# EasyEDA Pro project megaduck.epro

# Schematic Schematic1
Board Name: Board1; Create Date: 2025-01-31; Page Name: P1; Project Name: mega 2560 duck; Schematic Name: Schematic1; Update Date: 2025-01-31; Company: EasyEDA.com; Page Size: A4; Version: V1.0
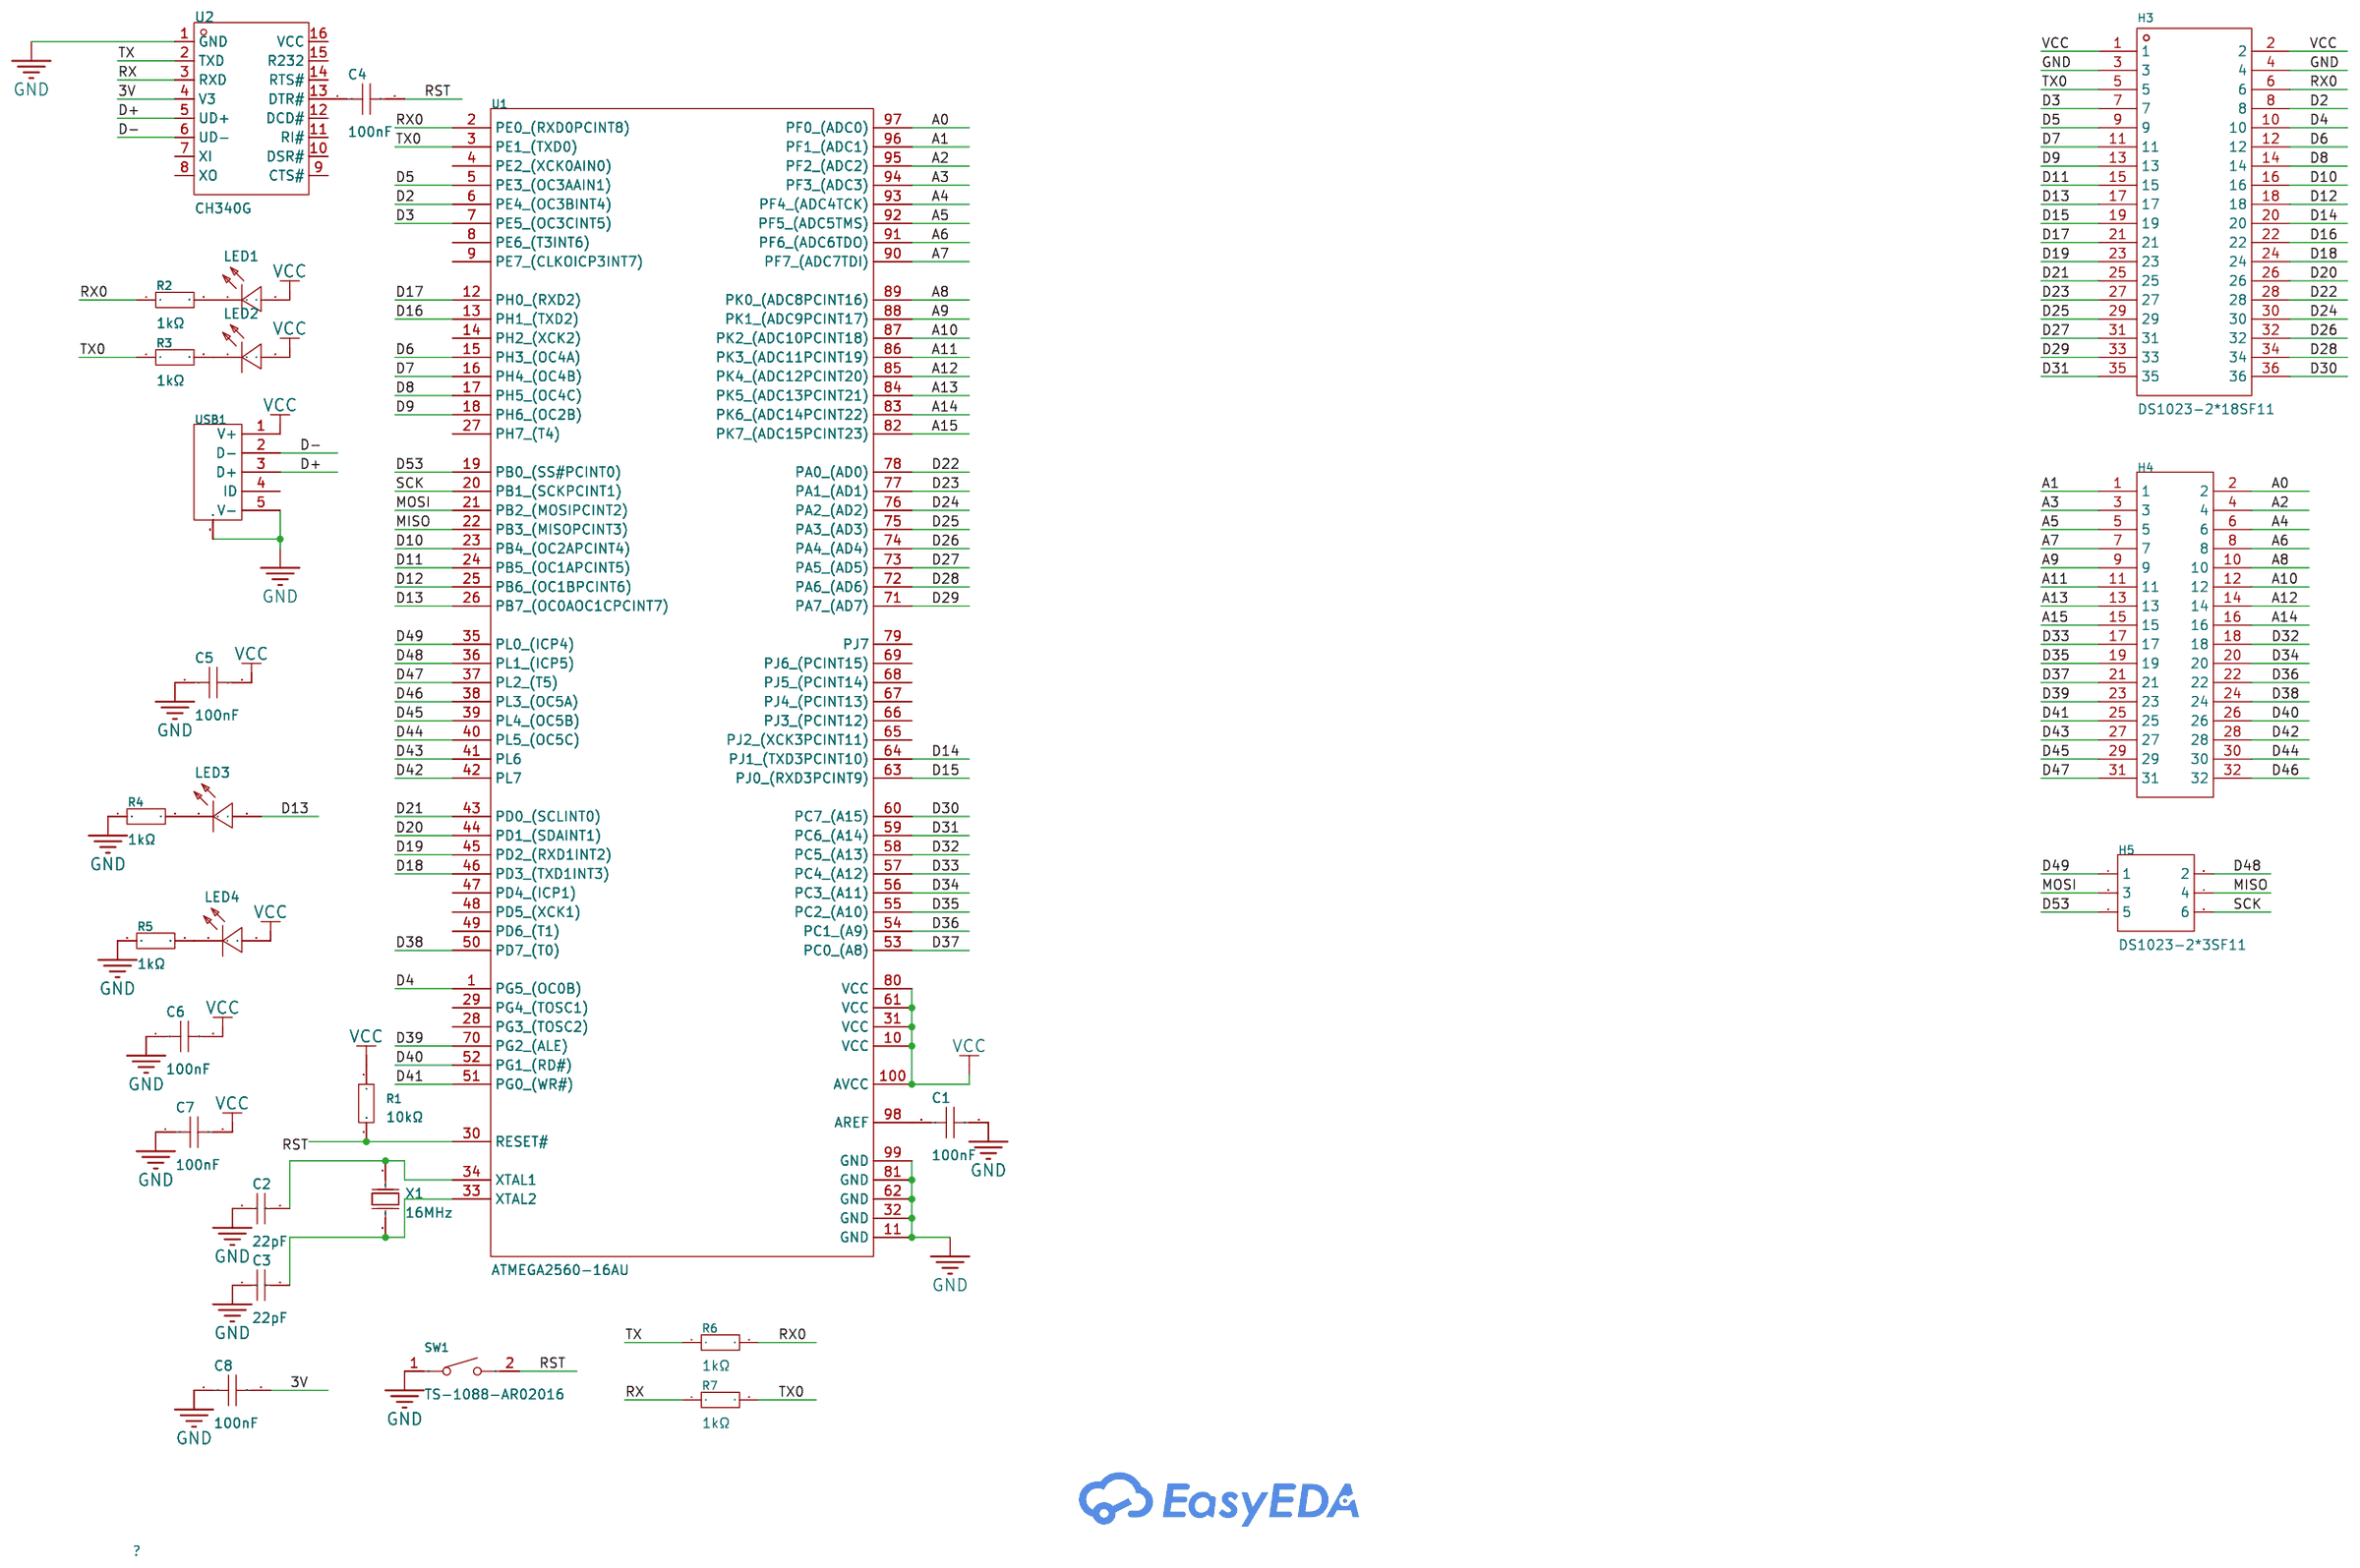
[diagram p0: schematic sheet]

## Parts
C1  100nF  [C0402]
C2  22pF  [C0402]
C3  22pF  [C0402]
C4  100nF  [C0402]
C5  100nF  [C0402]
C6  100nF  [C0402]
C7  100nF  [C0402]
C8  100nF  [C0402]
H3  DS1023-2*18SF11  [HDR-TH_36P-P2.54-V-F-R2-C18-S2.54-1]
H4  DS1023-2*16SF11  [HDR-TH_32P-P2.54-V-F-R2-C16-S2.54-1]
H5  DS1023-2*3SF11  [HDR-TH_6P-P2.54-V-F-R2-C3-S2.54]
LED1  KT-0603R  [LED0603-RD]
LED2  KT-0603R  [LED0603-RD]
LED3  KT-0603R  [LED0603-RD]
LED4  KT-0603R  [LED0603-RD]
R1  10kΩ  [R1206]
R2  1kΩ  [R1206]
R3  1kΩ  [R1206]
R4  1kΩ  [R1206]
R5  1kΩ  [R1206]
R6  1kΩ  [R1206]
R7  1kΩ  [R1206]
SW1  TS-1088-AR02016  [SW-SMD_L3.9-W3.0-P4.45]
U1  ATMEGA2560-16AU  [TQFP-100_L14.0-W14.0-P0.50-LS16.0-BL]
U2  CH340G  [SOIC-16_L9.9-W3.9-P1.27-LS6.0-BL]
USB1  920-E52A2021S10100  [MICRO-USB-SMD_5P-P0.65-H-F_C10418]
X1  16MHz  [HC-49S_L11.4-W4.8]

## Library data of the parts
C1 C4-C8 = CL05B104KO5NNNC: Capacitance: Tolerance:±10% Tolerance:±10% Voltage Rated: Temperature Coefficient:; LCSC Part Name: 100nF ±10% 16V; Supplier Part: C1525; Manufacturer: SAMSUNG(三星); Supplier Footprint: 0402; JLCPCB Part Class: Basic Part; Datasheet: https://atta.szlcsc.com/upload/public/pdf/source/20160218/1457707763339.pdf; Supplier: LCSC; Tolerance: ±10%
C2 C3 = 0402CG220J500NT: Capacitance: Tolerance:±5% Tolerance:±5% Voltage Rated: Temperature Coefficient:; LCSC Part Name: 22pF ±5% 50V; Supplier Part: C1555; Manufacturer: FH(风华); Supplier Footprint: 0402; JLCPCB Part Class: Basic Part; Datasheet: https://atta.szlcsc.com/upload/public/pdf/source/20200305/C486355_26A10D38EF8C2A5C37091D0039909270.pdf; Supplier: LCSC; Tolerance: ±5%
H3 = DS1023-2*18SF11: Holes Structure:2x18P Pitch:2.54mm Row Spacing:2.54mm Mounting Type:Straight Number of Rows:双排 Number of Holes:36P Insulation Height:- Contact Material:- Contact Plating:-; LCSC Part Name: 间距:2.54mm 2x18P 直插; Supplier Part: C132131; Manufacturer: CONNFLY; Supplier Footprint: 插件,P=2.54mm; JLCPCB Part Class: Extended Part; Datasheet: https://atta.szlcsc.com/upload/public/pdf/source/20170925/C132132_1506321659018990428.pdf; Supplier: LCSC; Holes Structure: 2x18P; Pitch: 2.54mm; Row Spacing: 2.54mm; Mounting Type: Straight; Number of Rows: 双排; Number of Holes: 36P
H4 = DS1023-2*16SF11: Holes Structure:2x16P Pitch:2.54mm Row Spacing:2.54mm Mounting Type:Straight Number of Rows:双排 Number of Holes:32P Insulation Height:- Contact Material:- Contact Plating:-; LCSC Part Name: 间距:2.54mm 2x16P 直插; Supplier Part: C132130; Manufacturer: CONNFLY; Supplier Footprint: 插件,P=2.54mm; JLCPCB Part Class: Extended Part; Datasheet: https://atta.szlcsc.com/upload/public/pdf/source/20170925/C132132_1506321659018990428.pdf; Supplier: LCSC; Holes Structure: 2x16P; Pitch: 2.54mm; Row Spacing: 2.54mm; Mounting Type: Straight; Number of Rows: 双排; Number of Holes: 32P
H5 = DS1023-2*3SF11: Holes Structure:2x3P Pitch:2.54mm Row Spacing:2.54mm Mounting Type:Straight Number of Rows:双排 Number of Holes:6P Insulation Height:- Contact Material:- Contact Plating:-; LCSC Part Name: 间距:2.54mm 2x3P 直插 黑色; Supplier Part: C92272; Manufacturer: CONNFLY; Supplier Footprint: 插件,P=2.54mm; JLCPCB Part Class: Extended Part; Datasheet: https://atta.szlcsc.com/upload/public/pdf/source/20200424/C92272_A95D2DA05ACA87B9C9B122019351705D.pdf; Supplier: LCSC; Holes Structure: 2x3P; Pitch: 2.54mm; Row Spacing: 2.54mm; Mounting Type: Straight; Number of Rows: 双排; Number of Holes: 6P
LED1-LED4 = KT-0603R: Emitted Color:Red Power Dissipation:- Forward Current:- Dominant Wavelength:- Dominant Wavelength:- Peak Wavelength:- Diode Configuration:- Lens Color:- Color Temperature:- Color Temperature:- Viewing Angle:- Mounting Sytle:- Operating Temperature:-40℃~+8; LCSC Part Name: 0603 红灯 高亮; Supplier Part: C2286; Manufacturer: KENTO; Supplier Footprint: 0603; JLCPCB Part Class: Basic Part; Datasheet: https://atta.szlcsc.com/upload/public/pdf/source/20160616/1466072038404.pdf; Supplier: LCSC; Emitted Color: Red; Operating Temperature: -40℃~+85℃
R1 = 1206W4J0103T5E: Type:Thick Film Resistors Resistance:10kΩ Tolerance:±5% Tolerance:±5% Power(Watts): Overload Voltage (Max): Temperature Coefficient:±100ppm/℃ Temperature Coefficient:±100ppm/℃ Operating Temperature Range:-55℃~+155℃ Operating Temperature Range:-55℃~+155℃; LCSC Part Name: 10kΩ ±5% 250mW 厚膜电阻; Supplier Part: C1489; Manufacturer: UNI-ROYAL(厚声); Supplier Footprint: 1206; JLCPCB Part Class: Extended Part; Datasheet: https://atta.szlcsc.com/upload/public/pdf/source/20200306/C422600_1E6D84923E4A46A82E41ADD87F860B5C.pdf; Supplier: LCSC; Type: Thick Film Resistors; Tolerance: ±5%; Temperature Coefficient: ±100ppm/℃; Operating Temperature Range: -55℃~+155℃
R2-R7 = 1206W4F1001T5E_C4410: Type:Thick Film Resistors Resistance:1kΩ Tolerance:±1% Tolerance:±1% Power(Watts): Overload Voltage (Max): Operating Temperature Range:-55℃~+155℃ Operating Temperature Range:-55℃~+155℃; LCSC Part Name: 1kΩ ±1% 250mW 厚膜电阻; Supplier Part: C4410; Manufacturer: UNI-ROYAL(厚声); Manufacturer Part: 1206W4F1001T5E; Supplier Footprint: 1206; JLCPCB Part Class: Basic Part; Datasheet: https://atta.szlcsc.com/upload/public/pdf/source/20200306/C422600_1E6D84923E4A46A82E41ADD87F860B5C.pdf; Supplier: LCSC; Type: Thick Film Resistors; Tolerance: ±1%; Operating Temperature Range: -55℃~+155℃
SW1 = TS-1088-AR02016: Circuit:SPST Actuator Style:Round Button Operating Force:160gf Mounting Style:Brick nogging Switch Length:4mm Switch Width:3mm Switch Height:2mm Strike Gundam:不带 Contact Current:50mA Voltage Rating (DC):12V Insulation Resistance:100MΩ Actuator/Cap Color:B; LCSC Part Name: 4*3*2mm 立贴 轻触开关; Supplier Part: C720477; Manufacturer: XUNPU(讯普); Supplier Footprint: SMD; JLCPCB Part Class: Extended Part; Datasheet: https://atta.szlcsc.com/upload/public/pdf/source/20200810/C720475_60D09DD6C54279ADDB2DC25100F1CC11.pdf; Supplier: LCSC; Circuit: SPST; Actuator Style: Round Button; Operating Force: 160gf; Mounting Style: Brick nogging; Switch Length: 4mm; Switch Width: 3mm; Switch Height: 2mm; Strike Gundam: 不带; Contact Current: 50mA; Voltage Rating (DC): 12V; Insulation Resistance: 100MΩ; Actuator/Cap Color: Black; Pin Style: SMDSplicing; Mechanical Life: 10万次; Operating Temperature: -30℃~+80℃
U1 = ATMEGA2560-16AU: CPU Core:AVR Program Storage Size:256KB RAM Size:8KB GPIO Ports Number:86 Operating Voltage Range:4.5V~5.5V Operating Voltage Range:4.5V~5.5V CPU Maximum Speed:16MHz Program Memory Type:FLASH EEPROM:4KB Operating Temperature Range:-40℃~+85℃ Operating Temp; LCSC Part Name: ATMEGA2560-16AU MSL=3; Supplier Part: C22460; Manufacturer: MICROCHIP(美国微芯); Supplier Footprint: TQFP-100(14x14); JLCPCB Part Class: Extended Part; Datasheet: https://atta.szlcsc.com/upload/public/pdf/source/20180629/C184061_12C3FF49A7078B074E4E6578B2EA6640.pdf; Supplier: LCSC; CPU Core: AVR; Program Storage Size: 256KB; RAM Size: 8KB; GPIO Ports Number: 86; Operating Voltage Range: 4.5V~5.5V; CPU Maximum Speed: 16MHz; Program Memory Type: FLASH; EEPROM: 4KB; Operating Temperature Range: -40℃~+85℃; ADC (Bit): 10bit; Peripheral/Function: WDT；PWM; Watchdog: 有; Low-Voltage Detect: 有; Internal Oscillator: 有
U2 = CH340G: Applications Function:USB to UART Protocol: Supply Voltage:5V；3.3V Supply Voltage:5V；3.3V Data Rate:2Mbps Operating Temperature:-40℃~+85℃ Operating Temperature:-40℃~+85℃; LCSC Part Name: USB转串口芯片CH340; Supplier Part: C14267; Manufacturer: WCH(南京沁恒); Supplier Footprint: SOP-16; JLCPCB Part Class: Extended Part; Datasheet: https://atta.szlcsc.com/upload/public/pdf/source/20240313/8510303D24D987FBF1AD30058571F10E.pdf; Supplier: LCSC; Applications Function: USB to UART; Supply Voltage: 5V；3.3V; Data Rate: 2Mbps; Operating Temperature: -40℃~+85℃
USB1 = 920-E52A2021S10100: Connector Type:Micro-B Standard:USB 2.0 Gender:Female Number of Ports:1 Number of Contacts:5P Current Rating - Power (Max):1A; LCSC Part Name: Micro-B 母; Supplier Part: C10418; Manufacturer: 精拓金; Supplier Footprint: SMD; JLCPCB Part Class: Extended Part; Datasheet: https://atta.szlcsc.com/upload/public/pdf/source/20210305/C10418_4890444E73C7CF5EB311058F76E5ECA4.pdf; Supplier: LCSC; Connector Type: Micro-B; Standard: USB 2.0; Gender: Female; Number of Ports: 1; Number of Contacts: 5P; Current Rating - Power (Max): 1A
X1 = X49SM16MSD2SC: Crystal Type:Surface Mount Crystal Frequency: Normal temperature Frequency Tolerance:±20ppm Normal temperature Frequency Tolerance:±20ppm External load capacitor: Frequency Stability(Full temperature range):±30ppm Frequency Stability(Full temperature rang; LCSC Part Name: 16MHz ±20ppm 20pF; Supplier Part: C12676; Manufacturer: YXC(扬兴晶振); Supplier Footprint: HC-49S-SMD; JLCPCB Part Class: Extended Part; Datasheet: https://atta.szlcsc.com/upload/public/pdf/source/20240329/3EBF42EBCAB50CA65B6FA9D7CFA1955A.pdf; Supplier: LCSC; Crystal Type: Surface Mount Crystal; Normal temperature Frequency Tolerance: ±20ppm; Frequency Stability(Full temperature range): ±30ppm

## Nets
3V: C8.2 U2.4(V3)
GND: C1.2 C2.1 C3.1 C5.1 C6.1 C7.1 C8.1 H3.3 H3.4 R4.1 R5.1 SW1.1 U1.11(GND) U1.32(GND) U1.62(GND) U1.81(GND) U1.99(GND) U2.1(GND) USB1.5(V-) USB1.SH0(MTN) USB1.SH1(1) USB1.SH2(2) USB1.SH3(3)
VCC: C5.2 C6.2 C7.2 H3.1 H3.2 LED1.2(A) LED2.2(A) LED4.2(A) R1.1 U1.10(VCC) U1.31(VCC) U1.61(VCC) U1.80(VCC) U1.100(AVCC) USB1.1(V+)
A0: H4.2 U1.97(PF0 (ADC0))
A1: H4.1 U1.96(PF1 (ADC1))
A2: H4.4 U1.95(PF2 (ADC2))
A3: H4.3 U1.94(PF3 (ADC3))
A4: H4.6 U1.93(PF4 (ADC4TCK))
A5: H4.5 U1.92(PF5 (ADC5TMS))
A6: H4.8 U1.91(PF6 (ADC6TDO))
A7: H4.7 U1.90(PF7 (ADC7TDI))
A8: H4.10 U1.89(PK0 (ADC8PCINT16))
A9: H4.9 U1.88(PK1 (ADC9PCINT17))
A10: H4.12 U1.87(PK2 (ADC10PCINT18))
A11: H4.11 U1.86(PK3 (ADC11PCINT19))
A12: H4.14 U1.85(PK4 (ADC12PCINT20))
A13: H4.13 U1.84(PK5 (ADC13PCINT21))
A14: H4.16 U1.83(PK6 (ADC14PCINT22))
A15: H4.15 U1.82(PK7 (ADC15PCINT23))
D2: H3.8 U1.6(PE4 (OC3BINT4))
D3: H3.7 U1.7(PE5 (OC3CINT5))
D4: H3.10 U1.1(PG5 (OC0B))
D5: H3.9 U1.5(PE3 (OC3AAIN1))
D6: H3.12 U1.15(PH3 (OC4A))
D7: H3.11 U1.16(PH4 (OC4B))
D8: H3.14 U1.17(PH5 (OC4C))
D9: H3.13 U1.18(PH6 (OC2B))
D10: H3.16 U1.23(PB4 (OC2APCINT4))
D11: H3.15 U1.24(PB5 (OC1APCINT5))
D12: H3.18 U1.25(PB6 (OC1BPCINT6))
D13: H3.17 LED3.2(A) U1.26(PB7 (OC0AOC1CPCINT7))
D14: H3.20 U1.64(PJ1 (TXD3PCINT10))
D15: H3.19 U1.63(PJ0 (RXD3PCINT9))
D16: H3.22 U1.13(PH1 (TXD2))
D17: H3.21 U1.12(PH0 (RXD2))
D18: H3.24 U1.46(PD3 (TXD1INT3))
D19: H3.23 U1.45(PD2 (RXD1INT2))
D20: H3.26 U1.44(PD1 (SDAINT1))
D21: H3.25 U1.43(PD0 (SCLINT0))
D22: H3.28 U1.78(PA0 (AD0))
D23: H3.27 U1.77(PA1 (AD1))
D24: H3.30 U1.76(PA2 (AD2))
D25: H3.29 U1.75(PA3 (AD3))
D26: H3.32 U1.74(PA4 (AD4))
D27: H3.31 U1.73(PA5 (AD5))
D28: H3.34 U1.72(PA6 (AD6))
D29: H3.33 U1.71(PA7 (AD7))
D30: H3.36 U1.60(PC7 (A15))
D31: H3.35 U1.59(PC6 (A14))
D32: H4.18 U1.58(PC5 (A13))
D33: H4.17 U1.57(PC4 (A12))
D34: H4.20 U1.56(PC3 (A11))
D35: H4.19 U1.55(PC2 (A10))
D36: H4.22 U1.54(PC1 (A9))
D37: H4.21 U1.53(PC0 (A8))
D38: H4.24 U1.50(PD7 (T0))
D39: H4.23 U1.70(PG2 (ALE))
D40: H4.26 U1.52(PG1 (RD#))
D41: H4.25 U1.51(PG0 (WR#))
D42: H4.28 U1.42(PL7)
D43: H4.27 U1.41(PL6)
D44: H4.30 U1.40(PL5 (OC5C))
D45: H4.29 U1.39(PL4 (OC5B))
D46: H4.32 U1.38(PL3 (OC5A))
D47: H4.31 U1.37(PL2 (T5))
D48: H5.2 U1.36(PL1 (ICP5))
D49: H5.1 U1.35(PL0 (ICP4))
D53: H5.5 U1.19(PB0 (SS#PCINT0))
D+: U2.5(UD+) USB1.3(D+)
D-: U2.6(UD-) USB1.2(D-)
MISO: H5.4 U1.22(PB3 (MISOPCINT3))
MOSI: H5.3 U1.21(PB2 (MOSIPCINT2))
RST: C4.2 R1.2 SW1.2 U1.30(RESET#)
RX: R7.1 U2.3(RXD)
RX0: H3.6 R2.1 R6.2 U1.2(PE0 (RXD0PCINT8))
SCK: H5.6 U1.20(PB1 (SCKPCINT1))
TX: R6.1 U2.2(TXD)
TX0: H3.5 R3.1 R7.2 U1.3(PE1 (TXD0))
$1N1069: C1.1 U1.98(AREF)
$1N1420: C2.2 U1.34(XTAL1) X1.1(OSC1)
$1N1443: C3.2 U1.33(XTAL2) X1.2(OSC2)
$1N1959: C4.1 U2.13(DTR#)
Net-(LED1-1): LED1.1(K) R2.2
Net-(LED2-1): LED2.1(K) R3.2
Net-(LED3-1): LED3.1(K) R4.2
Net-(LED4-1): LED4.1(K) R5.2

Not connected (* = marked no-connect by the designer): U1 4(PE2 (XCK0AIN0)) 8(PE6 (T3INT6)) 9(PE7 (CLKOICP3INT7)) 14(PH2 (XCK2)) 27(PH7 (T4)) 28(PG3 (TOSC2)) 29(PG4 (TOSC1)) 47(PD4 (ICP1)) 48(PD5 (XCK1)) 49(PD6 (T1)) 65(PJ2 (XCK3PCINT11)) 66(PJ3 (PCINT12)) 67(PJ4 (PCINT13)) 68(PJ5 (PCINT14)) 69(PJ6 (PCINT15)) 79(PJ7); U2 7(XI) 8(XO) 9(CTS#) 10(DSR#) 11(RI#) 12(DCD#) 14(RTS#) 15(R232) 16(VCC); USB1 4(ID)

# Board PCB1
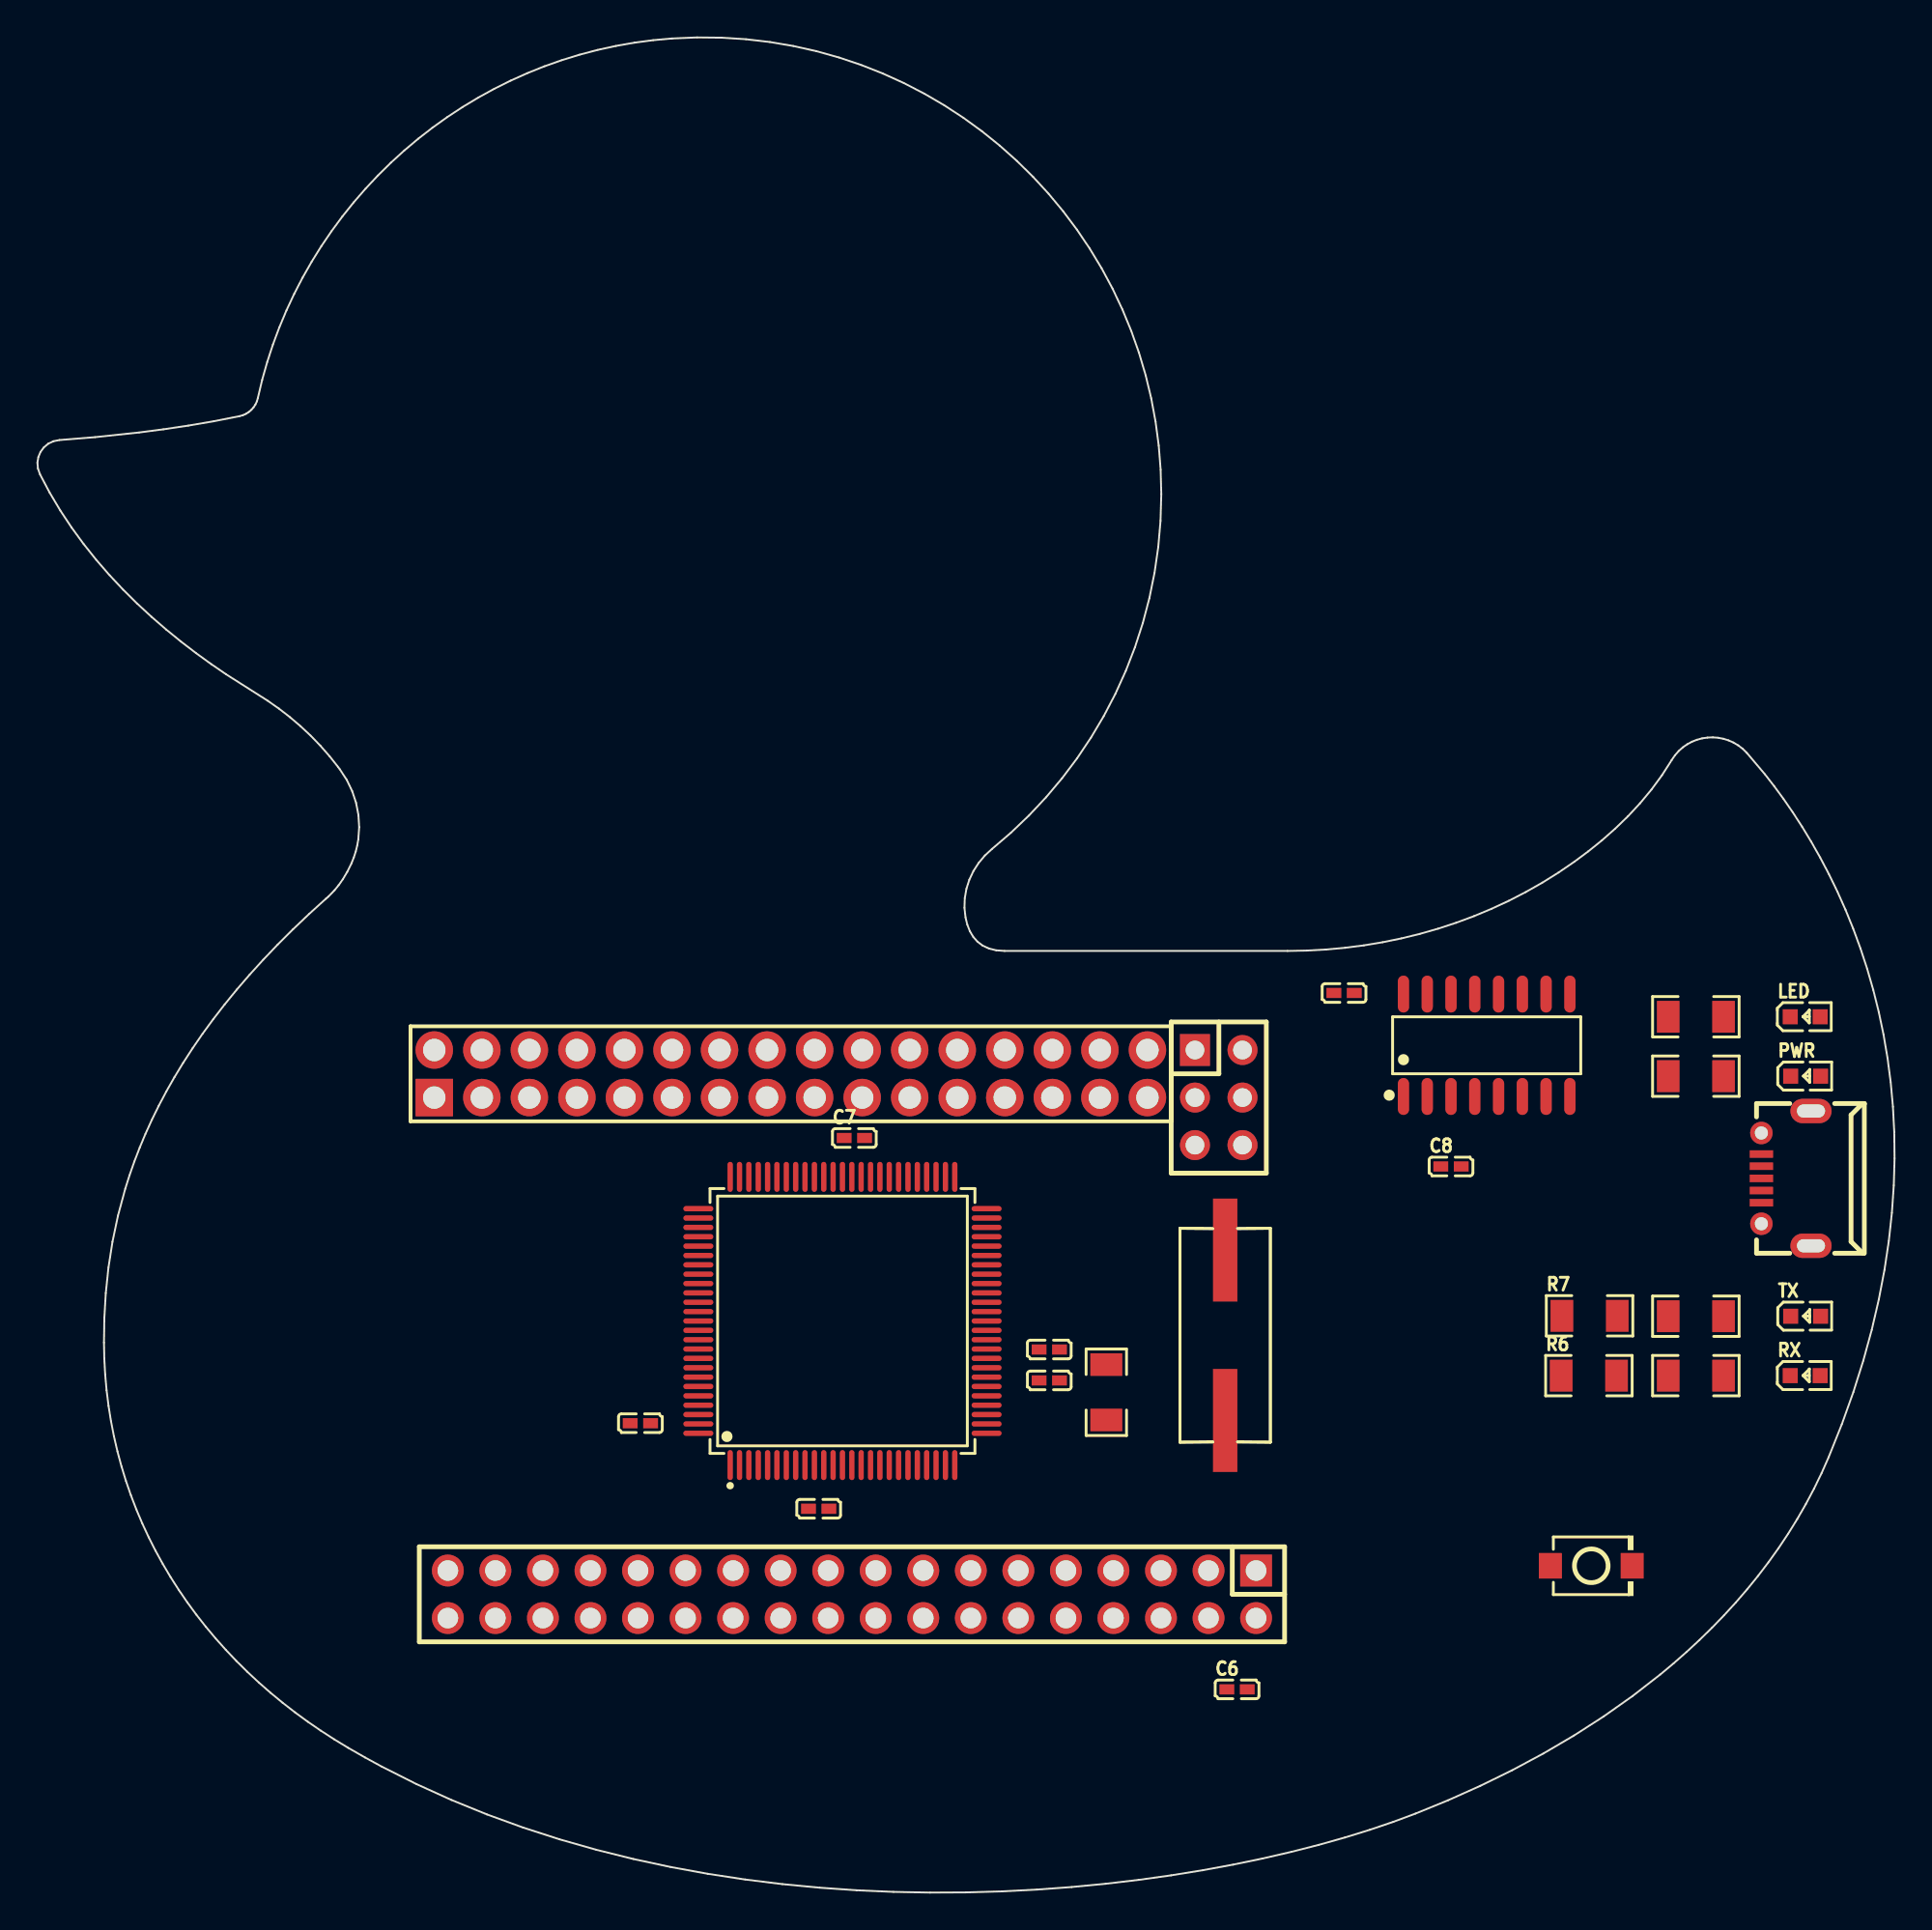
[diagram p1: board, top side]
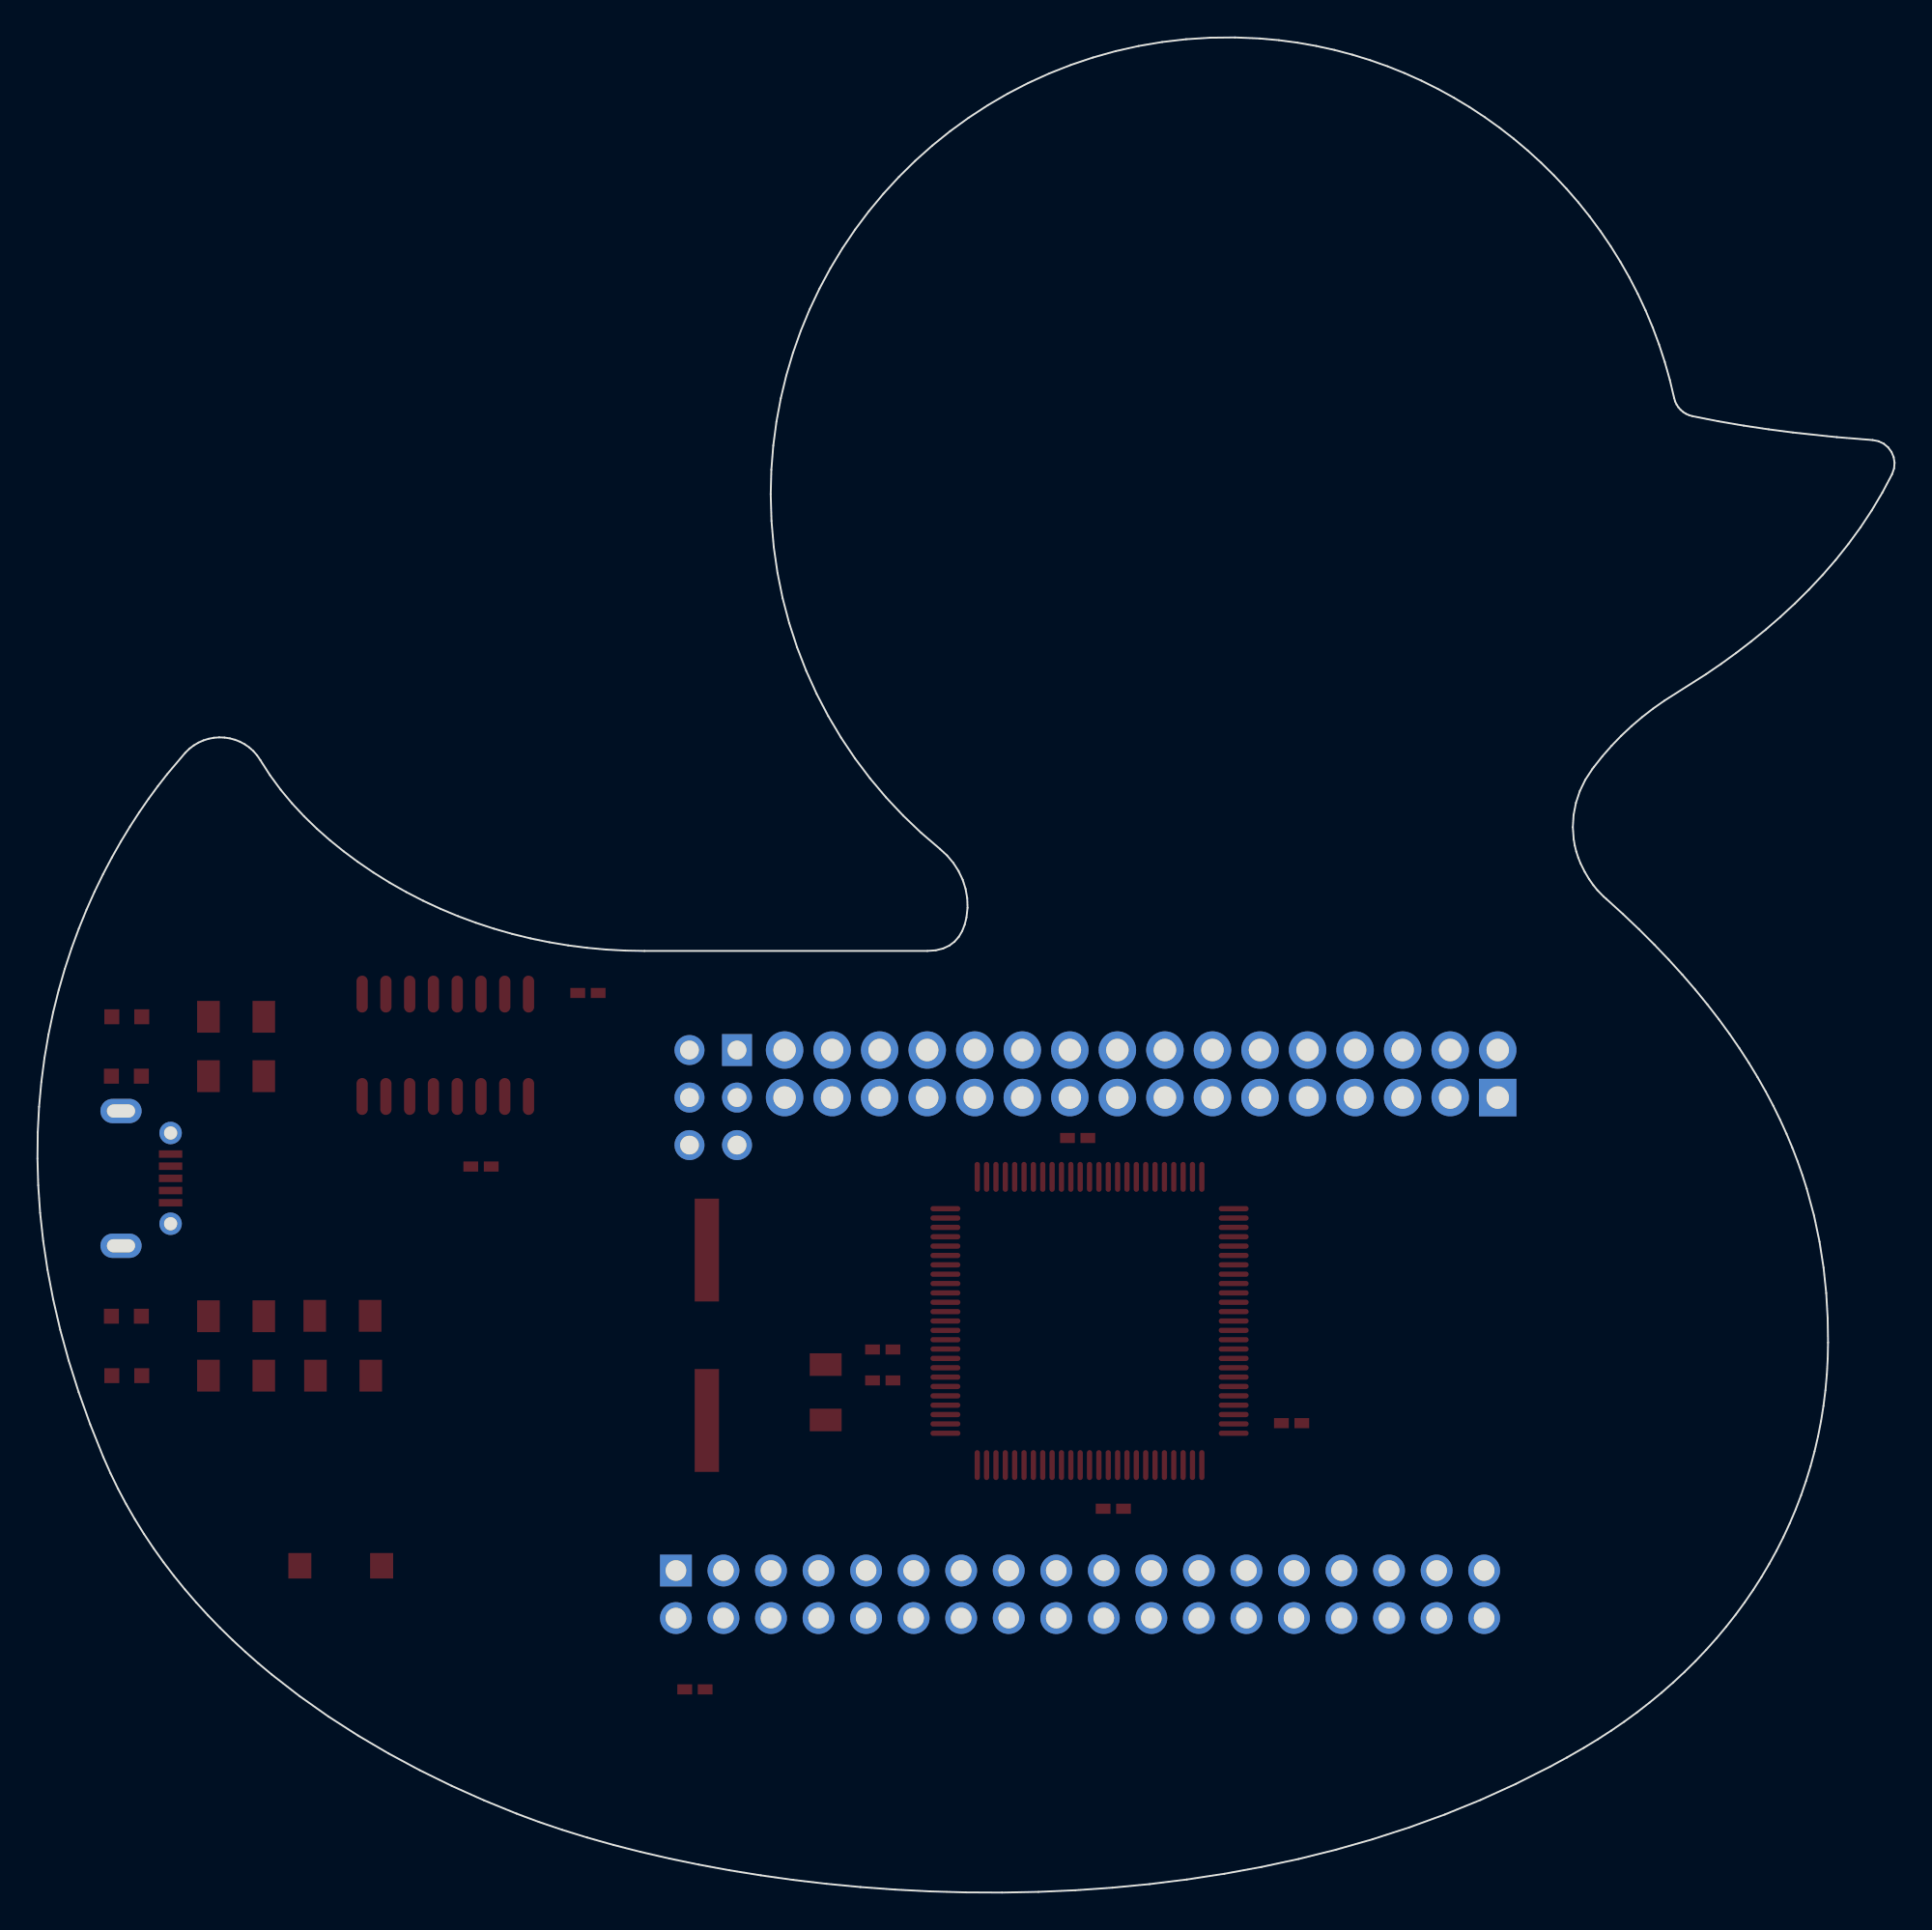
[diagram p2: board, bottom side, seen from below]

Outline 99.22 x 99.13 mm; copper layers: Top Layer, Bottom Layer. Coordinates in mm from the lower left corner of the outline.
Stack: Top Layer 0.035mm / Dielectric1 1.51mm FR4 er 4.5 / Bottom Layer 0.035mm

## Design rules (mm)
template: JLCPCB Capability(Two Layers Board)
spacing copperThickness1oz (default): track to track 0.102, other pairs 0.152 to 0.3
spacing copperThickness2oz: track to track 0.203, other pairs 0.152 to 0.3
track width copperThickness1oz (default): min 0.127, default 0.254, max 2.54
track width copperThickness2oz: min 0.203, default 0.254, max 2.54
differential pair differentialPair (default): width min 0.127, default 0.254, max 2.54; gap min 0.152, default 0.152
via viaSize (default): diameter min 0.5, default 0.61, max 10; hole min 0.3, default 0.305, max 6.3

## Placement (name value [footprint] x y rotation side)
C1  100nF  [C0402]  32.21 25.08 0 top
C2  22pF  [C0402]  54.06 29.02 180 top
C3  22pF  [C0402]  54.06 27.37 180 top
C4  100nF  [C0402]  69.81 48.07 180 top
C5  100nF  [C0402]  41.74 20.51 180 top
C6  100nF  [C0402]  64.09 10.86 0 top
C7  100nF  [C0402]  43.64 40.32 0 top
C8  100nF  [C0402]  75.52 38.8 0 top
H3  DS1023-2*18SF11  [HDR-TH_36P-P2.54-V-F-R2-C18-S2.54-1]  43.52 15.94 180 top
H4  DS1023-2*16SF11  [HDR-TH_32P-P2.54-V-F-R2-C16-S2.54-1]  40.25 43.75 0 top
H5  DS1023-2*3SF11  [HDR-TH_6P-P2.54-V-F-R2-C3-S2.54]  63.11 42.48 270 top
LED  KT-0603R  [LED0603-RD]  94.44 46.8 0 top
PWR  KT-0603R  [LED0603-RD]  94.47 43.62 0 top
R1  10kΩ  [R1206]  57.11 26.73 270 top
R2  1kΩ  [R1206]  88.6 27.62 0 top
R3  1kΩ  [R1206]  88.6 30.8 0 top
R4  1kΩ  [R1206]  88.6 46.8 0 top
R5  1kΩ  [R1206]  88.6 43.62 0 top
R6  1kΩ  [R1206]  82.89 27.62 0 top
R7  1kΩ  [R1206]  82.92 30.82 0 top
RX  KT-0603R  [LED0603-RD]  94.44 27.62 0 top
SW1  TS-1088-AR02016  [SW-SMD_L3.9-W3.0-P4.45]  83.01 17.46 0 top
TX  KT-0603R  [LED0603-RD]  94.47 30.8 0 top
U1  ATMEGA2560-16AU  [TQFP-100_L14.0-W14.0-P0.50-LS16.0-BL]  43.01 30.54 0 top
U2  CH340G  [SOIC-16_L9.9-W3.9-P1.27-LS6.0-BL]  77.43 45.27 0 top
USB1  920-E52A2021S10100  [MICRO-USB-SMD_5P-P0.65-H-F_C10418]  93.43 38.16 90 top
X1  16MHz  [HC-49S_L11.4-W4.8]  63.46 29.78 270 top

## Footprints (pads in the part's own frame, mm; a bottom-side part is the same pattern mirrored in y, then rotated)
C0402
  rect 0.79x0.54 smd: 1(-0.545,0) 2(0.545,0)
HC-49S_L11.4-W4.8
  rect 5.5x1.3 smd: 1(-4.553,0) 2(4.553,0)
HDR-TH_6P-P2.54-V-F-R2-C3-S2.54
  rect 1.7x1.6 hole 1: 1(-2.54,-1.27)
  round 1.6 hole 1: 2(-2.54,1.27) 3(0,-1.27) 4(0,1.27) 5(2.54,-1.27) 6(2.54,1.27)
HDR-TH_32P-P2.54-V-F-R2-C16-S2.54-1
  rect 2x2 hole 1.2: 1(-19.05,-1.27)
  round 2 hole 1.2: 2(-19.05,1.27) 3(-16.51,-1.27) 4(-16.51,1.27) 5(-13.97,-1.27) 6(-13.97,1.27) 7(-11.43,-1.27) 8(-11.43,1.27) 9(-8.89,-1.27) 10(-8.89,1.27) 11(-6.35,-1.27) 12(-6.35,1.27) 13(-3.81,-1.27) 14(-3.81,1.27) 15(-1.27,-1.27) 16(-1.27,1.27) 17(1.27,-1.27) 18(1.27,1.27) 19(3.81,-1.27) 20(3.81,1.27) 21(6.35,-1.27) 22(6.35,1.27) 23(8.89,-1.27) 24(8.89,1.27) 25(11.43,-1.27) 26(11.43,1.27) 27(13.97,-1.27) 28(13.97,1.27) 29(16.51,-1.27) 30(16.51,1.27) 31(19.05,-1.27) 32(19.05,1.27)
HDR-TH_36P-P2.54-V-F-R2-C18-S2.54-1
  rect 1.7x1.7 hole 1.1: 1(-21.59,-1.27)
  round 1.7 hole 1.1: 2(-21.59,1.27) 3(-19.05,-1.27) 4(-19.05,1.27) 5(-16.51,-1.27) 6(-16.51,1.27) 7(-13.97,-1.27) 8(-13.97,1.27) 9(-11.43,-1.27) 10(-11.43,1.27) 11(-8.89,-1.27) 12(-8.89,1.27) 13(-6.35,-1.27) 14(-6.35,1.27) 15(-3.81,-1.27) 16(-3.81,1.27) 17(-1.27,-1.27) 18(-1.27,1.27) 19(1.27,-1.27) 20(1.27,1.27) 21(3.81,-1.27) 22(3.81,1.27) 23(6.35,-1.27) 24(6.35,1.27) 25(8.89,-1.27) 26(8.89,1.27) 27(11.43,-1.27) 28(11.43,1.27) 29(13.97,-1.27) 30(13.97,1.27) 31(16.51,-1.27) 32(16.51,1.27) 33(19.05,-1.27) 34(19.05,1.27) 35(21.59,-1.27) 36(21.59,1.27)
LED0603-RD
  rect 0.8x0.8 smd: 1(-0.799,0) 2(0.799,0)
MICRO-USB-SMD_5P-P0.65-H-F_C10418
  rect 0.4x1.25 smd: 1(-1.3,1.325) 2(-0.65,1.325) 3(0,1.325) 4(0.65,1.325) 5(1.3,1.325)
  round 1.2 hole 0.7: SH0(-2.425,1.325) SH3(2.425,1.325)
  oval 1.3x2.2 hole 0.7x1.5: SH1(-3.6,-1.325) SH2(3.6,-1.325)
R1206
  rect 1.208x1.701 smd: 1(-1.479,0) 2(1.479,0)
SOIC-16_L9.9-W3.9-P1.27-LS6.0-BL
  oval 0.602x1.971 smd: 1(-4.445,-2.736) 2(-3.175,-2.736) 3(-1.905,-2.736) 4(-0.635,-2.736) 5(0.635,-2.736) 6(1.905,-2.736) 7(3.175,-2.736) 8(4.445,-2.736) 9(4.445,2.736) 10(3.175,2.736) 11(1.905,2.736) 12(0.635,2.736) 13(-0.635,2.736) 14(-1.905,2.736) 15(-3.175,2.736) 16(-4.445,2.736)
SW-SMD_L3.9-W3.0-P4.45
  rect 1.23x1.36 smd: 1(-2.185,0) 2(2.185,0)
TQFP-100_L14.0-W14.0-P0.50-LS16.0-BL
  oval 0.28x1.6 smd: 1(-6,-7.7) 2(-5.5,-7.7) 3(-5,-7.7) 4(-4.5,-7.7) 5(-4,-7.7) 6(-3.5,-7.7) 7(-3,-7.7) 8(-2.5,-7.7) 9(-2,-7.7) 10(-1.5,-7.7) 11(-1,-7.7) 12(-0.5,-7.7) 13(0,-7.7) 14(0.5,-7.7) 15(1,-7.7) 16(1.5,-7.7) 17(2,-7.7) 18(2.5,-7.7) 19(3,-7.7) 20(3.5,-7.7) 21(4,-7.7) 22(4.5,-7.7) 23(5,-7.7) 24(5.5,-7.7) 25(6,-7.7) 51(6,7.7) 52(5.5,7.7) 53(5,7.7) 54(4.5,7.7) 55(4,7.7) 56(3.5,7.7) 57(3,7.7) 58(2.5,7.7) 59(2,7.7) 60(1.5,7.7) 61(1,7.7) 62(0.5,7.7) 63(0,7.7) 64(-0.5,7.7) 65(-1,7.7) 66(-1.5,7.7) 67(-2,7.7) 68(-2.5,7.7) 69(-3,7.7) 70(-3.5,7.7) 71(-4,7.7) 72(-4.5,7.7) 73(-5,7.7) 74(-5.5,7.7) 75(-6,7.7)
  oval 1.6x0.28 smd: 26(7.7,-6) 27(7.7,-5.5) 28(7.7,-5) 29(7.7,-4.5) 30(7.7,-4) 31(7.7,-3.5) 32(7.7,-3) 33(7.7,-2.5) 34(7.7,-2) 35(7.7,-1.5) 36(7.7,-1) 37(7.7,-0.5) 38(7.7,0) 39(7.7,0.5) 40(7.7,1) 41(7.7,1.5) 42(7.7,2) 43(7.7,2.5) 44(7.7,3) 45(7.7,3.5) 46(7.7,4) 47(7.7,4.5) 48(7.7,5) 49(7.7,5.5) 50(7.7,6) 76(-7.7,6) 77(-7.7,5.5) 78(-7.7,5) 79(-7.7,4.5) 80(-7.7,4) 81(-7.7,3.5) 82(-7.7,3) 83(-7.7,2.5) 84(-7.7,2) 85(-7.7,1.5) 86(-7.7,1) 87(-7.7,0.5) 88(-7.7,0) 89(-7.7,-0.5) 90(-7.7,-1) 91(-7.7,-1.5) 92(-7.7,-2) 93(-7.7,-2.5) 94(-7.7,-3) 95(-7.7,-3.5) 96(-7.7,-4) 97(-7.7,-4.5) 98(-7.7,-5) 99(-7.7,-5.5) 100(-7.7,-6)

## Nets
As in the schematic, except:
VCC: C5.2 C6.2 C7.2 H3.1 H3.2 PWR.2 R1.1 RX.2 TX.2 U1.10 U1.31 U1.61 U1.80 U1.100 USB1.1
D13: H3.17 LED.2 U1.26
$1N2135: R2.2 RX.1
$1N2257: R3.2 TX.1
$1N2730: LED.1 R4.2
$1N2846: PWR.1 R5.2

Pads without a net: U1 4 8 9 14 27 28 29 47 48 49 65 66 67 68 69 79; U2 7 8 9 10 11 12 14 15 16; USB1 4

# Board PCB1_1
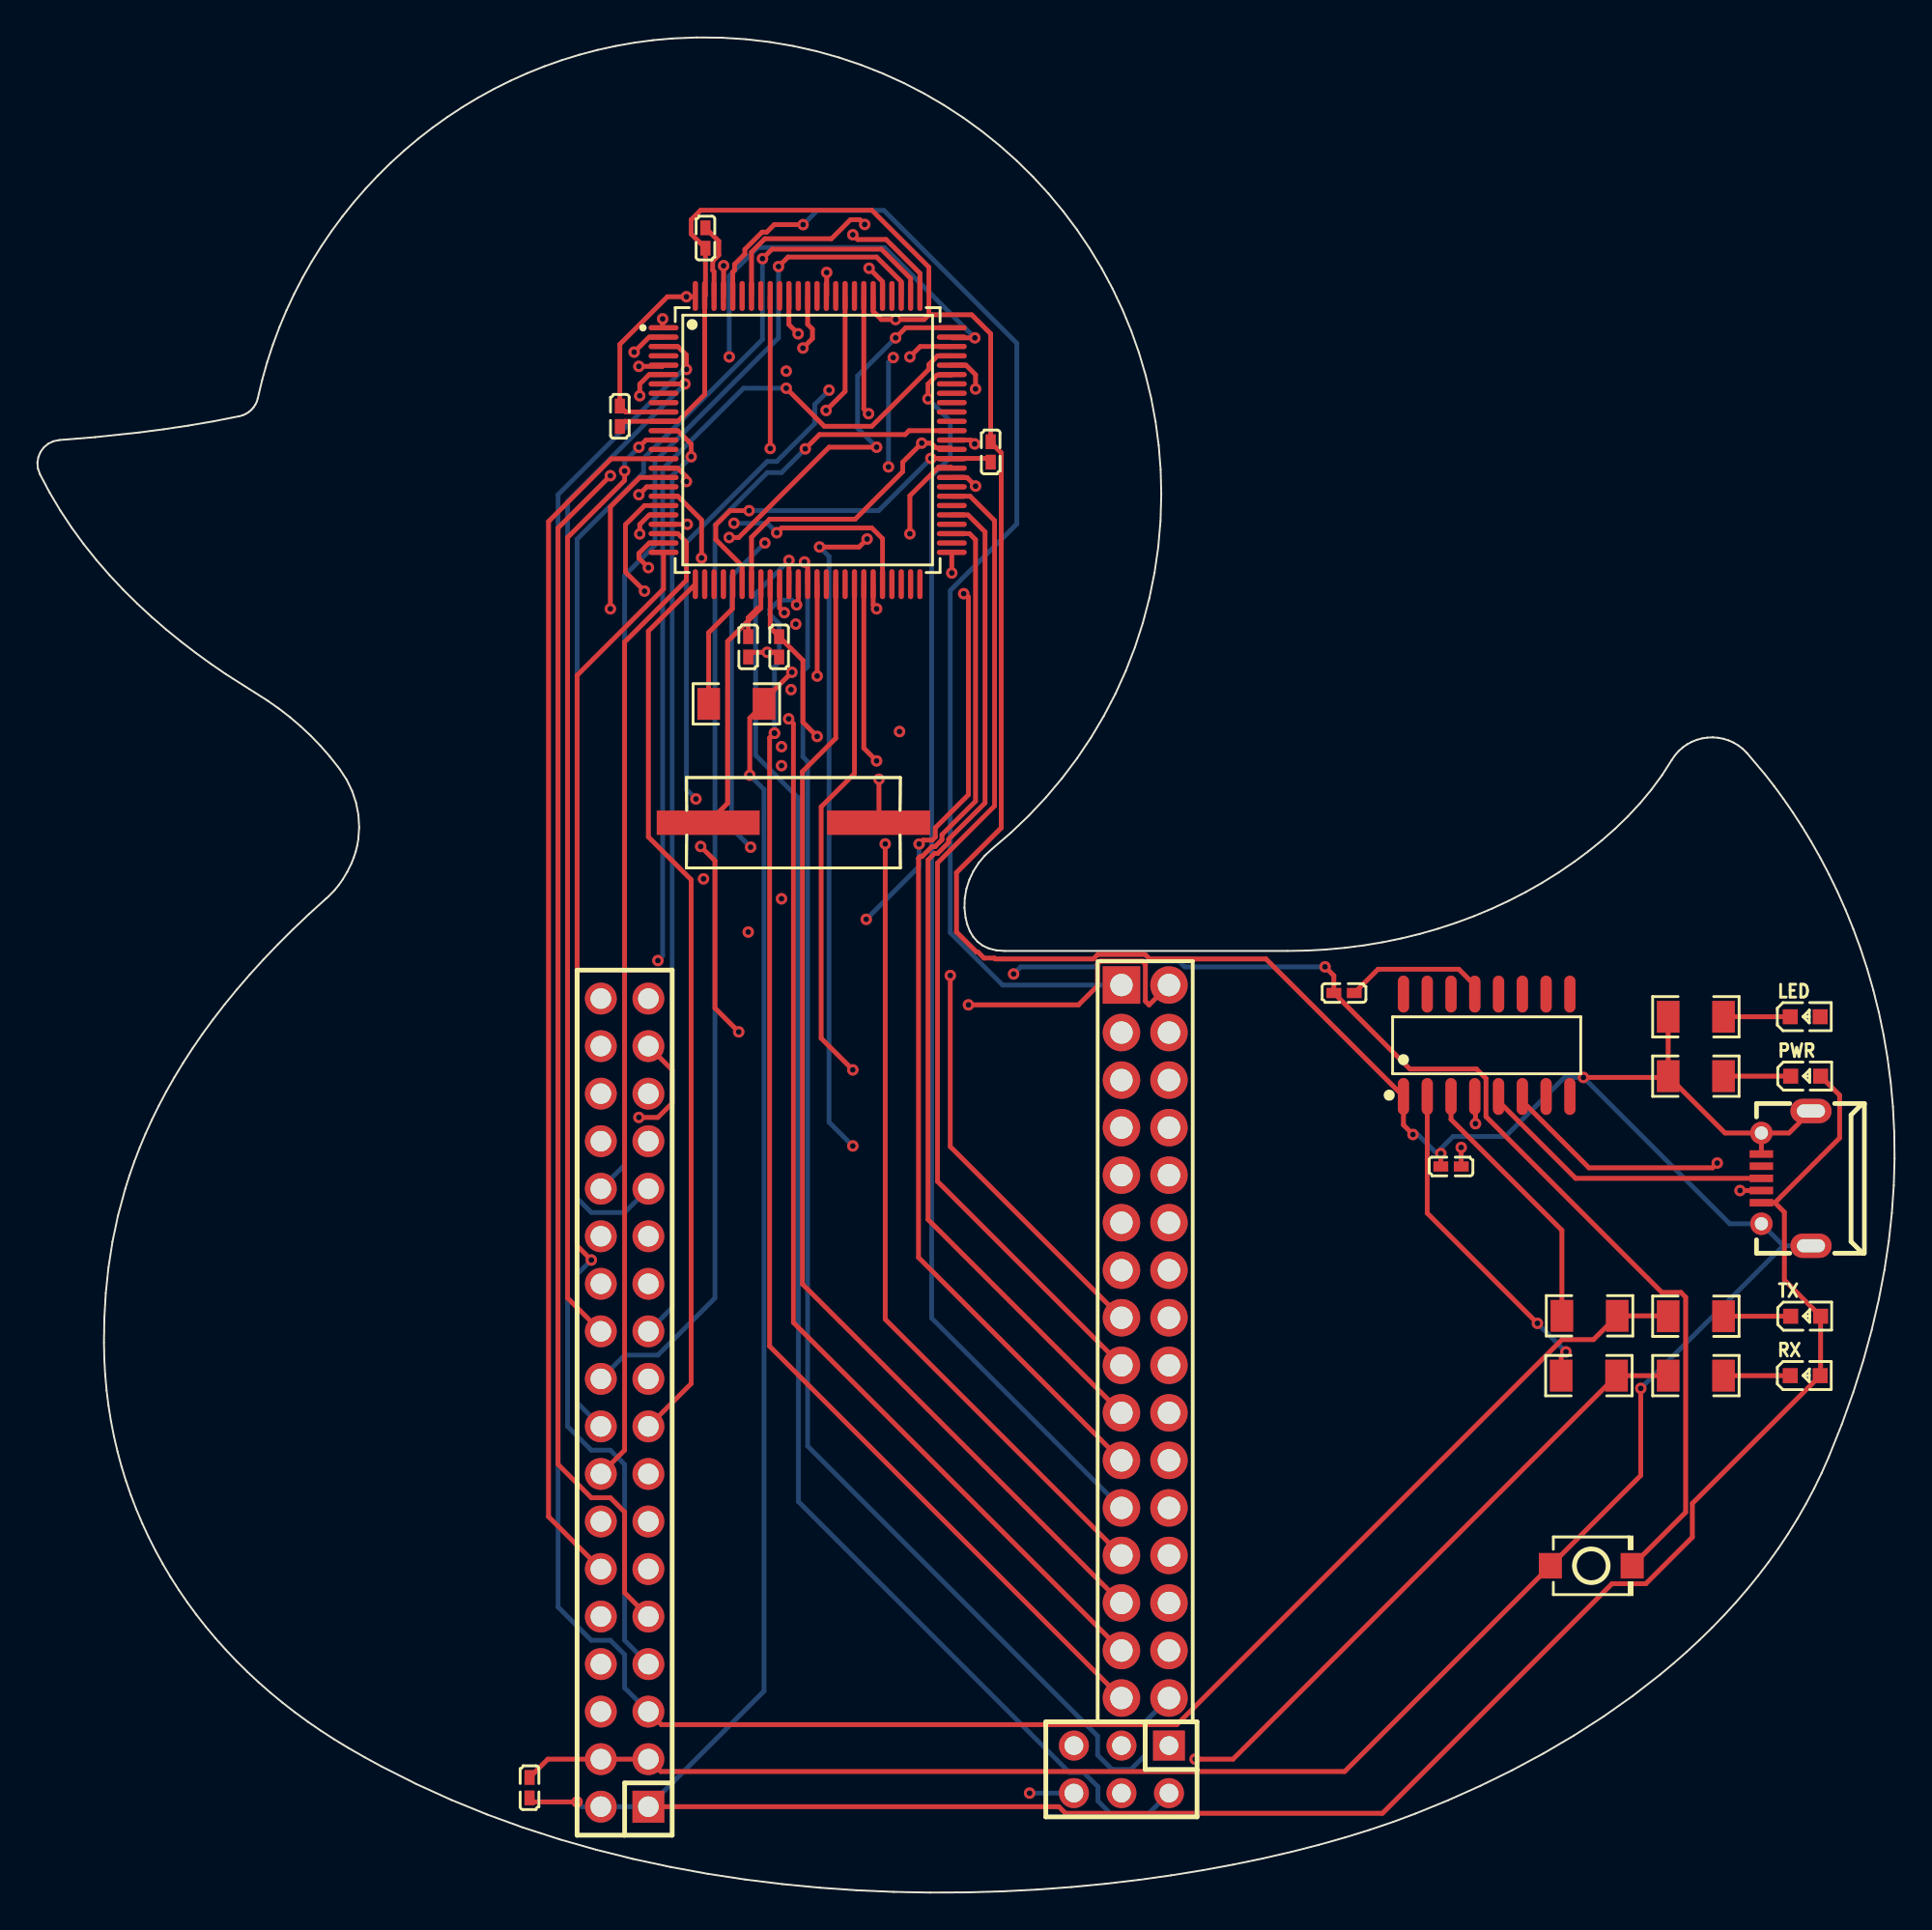
[diagram p3: board, top side]
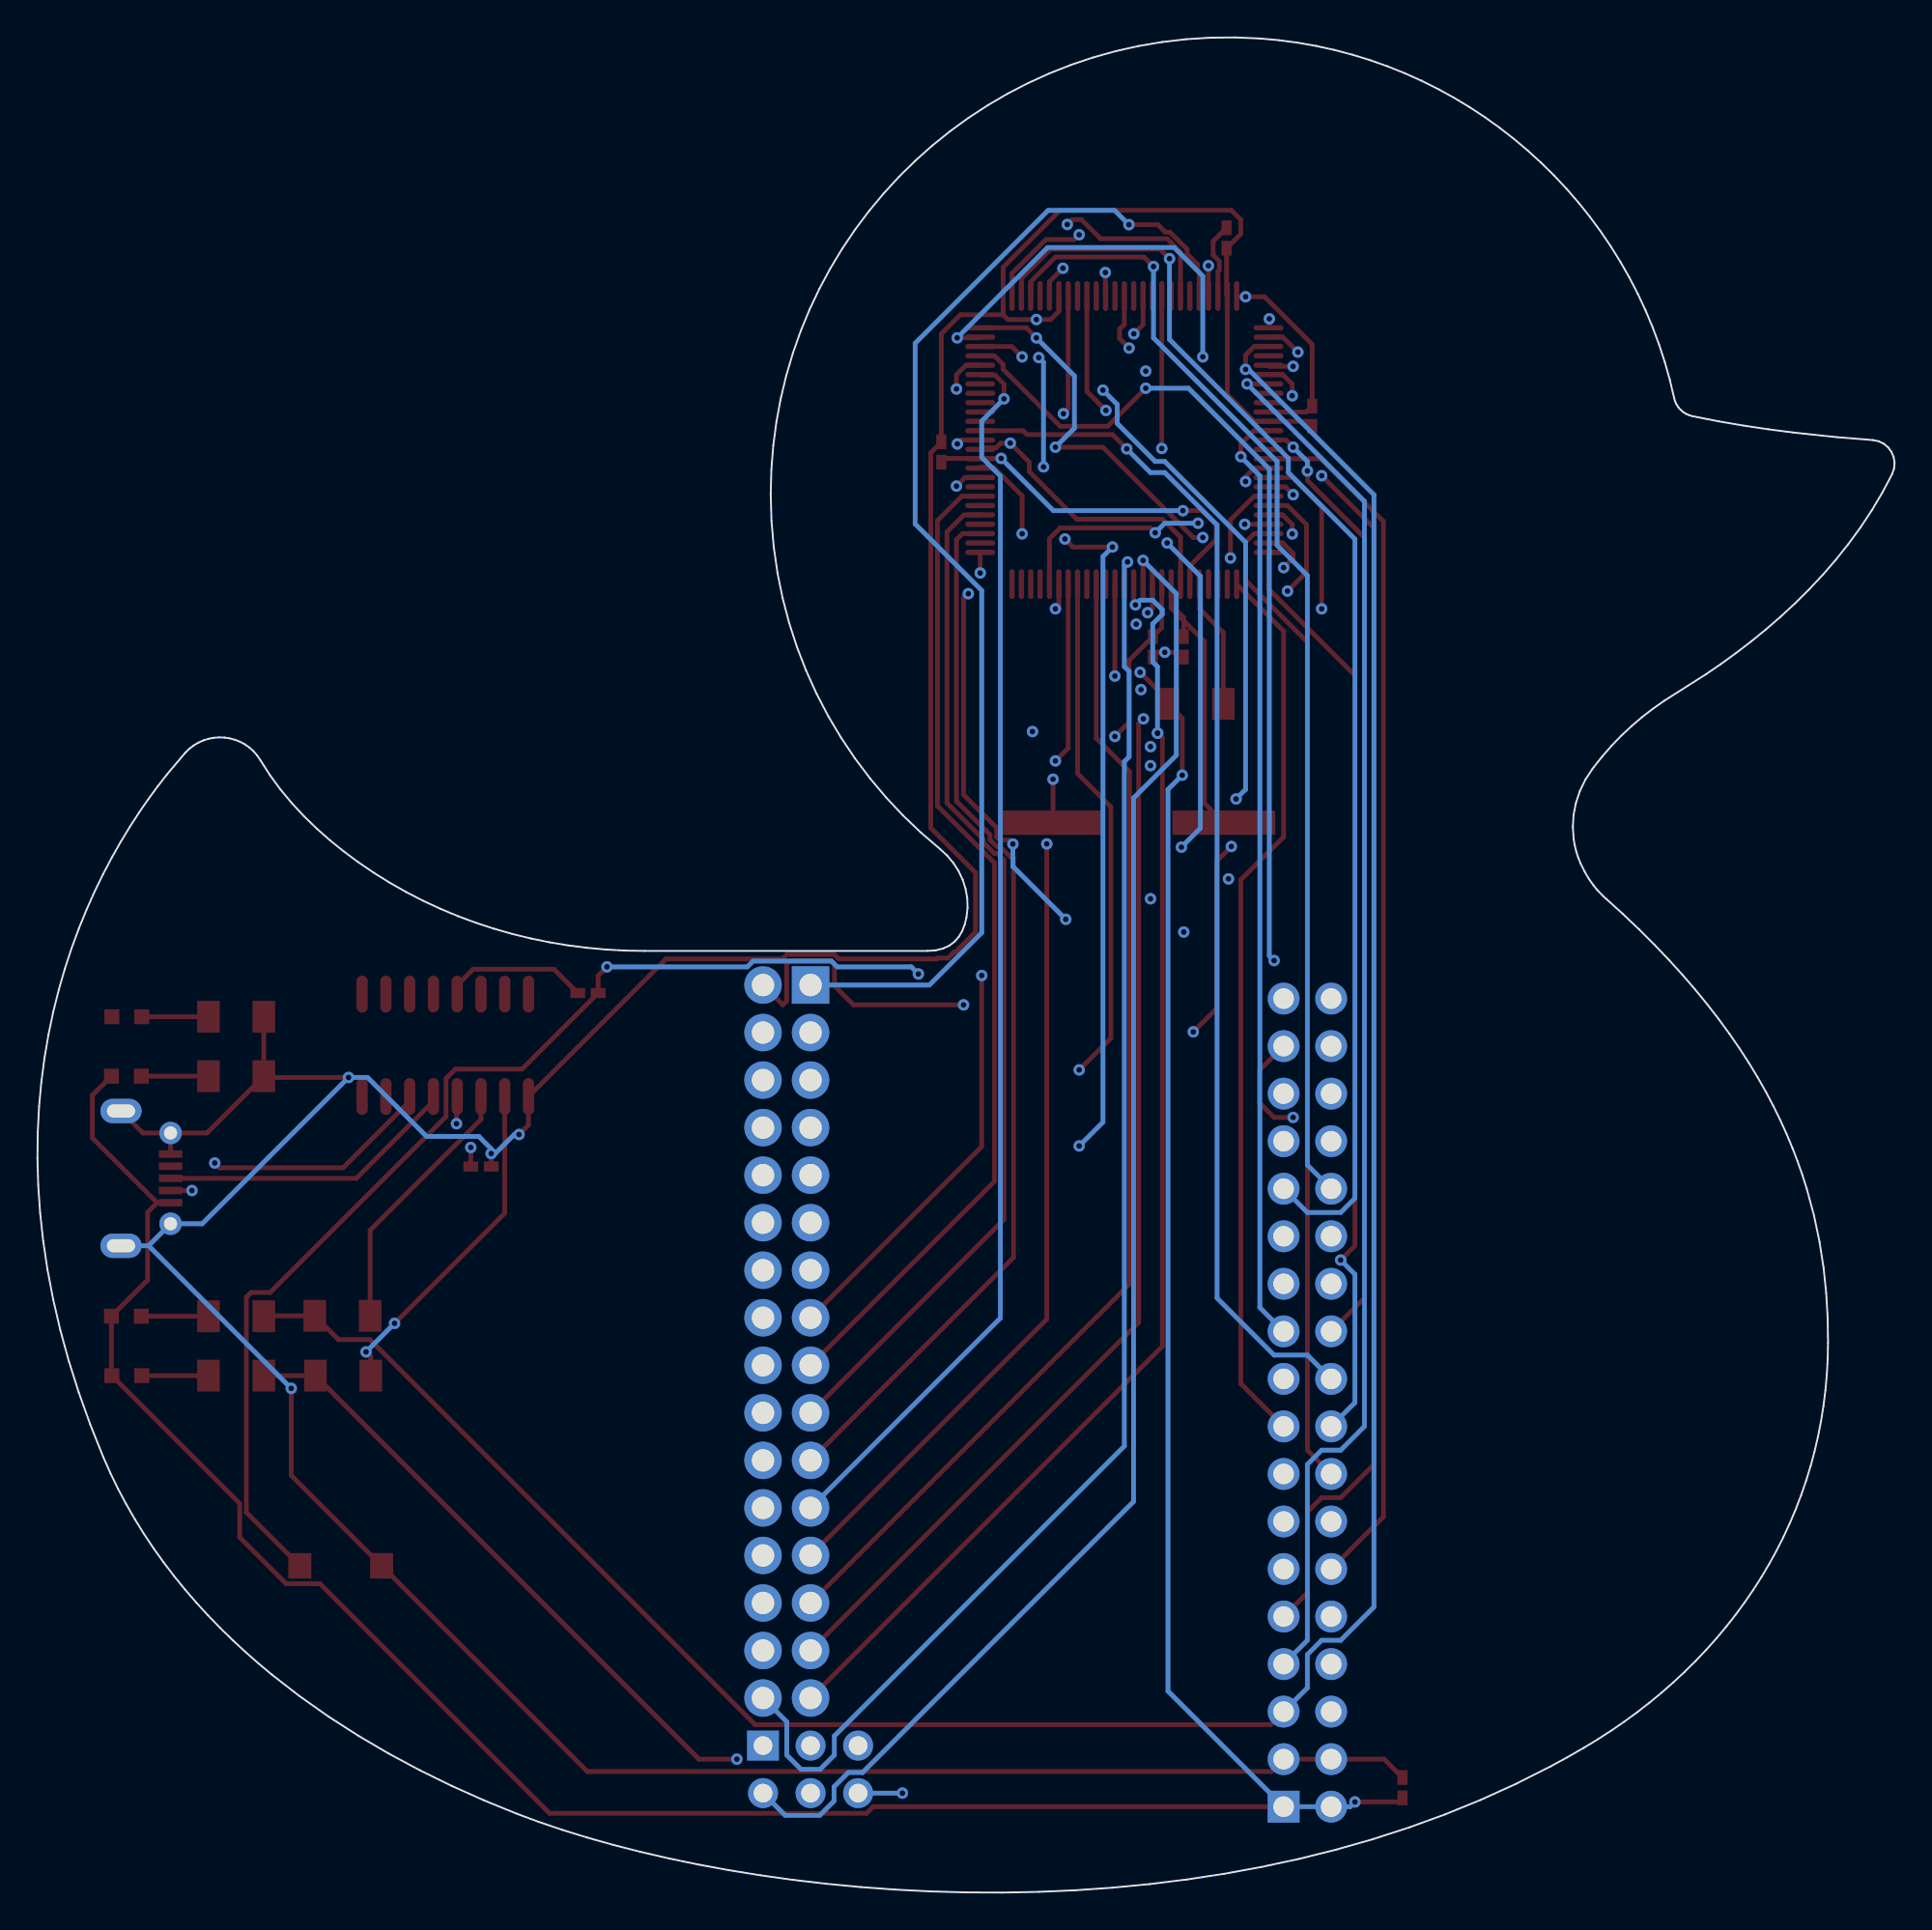
[diagram p4: board, bottom side, seen from below]

Outline 99.22 x 99.13 mm; copper layers: Top Layer, Inner1, Inner2, Bottom Layer. Coordinates in mm from the lower left corner of the outline.
Stack: Top Layer 0.035mm Outer layer thickness 1oz / Dielectric1 0.2104mm 7628 RC49% 8.6mil / Inner1 0.0152mm Inner layer thickness / Dielectric2 1.065mm 1.1mm H/HOZ Copper / Inner2 0.0152mm Inner layer thickness / Dielectric3 0.2104mm 7628 RC49% 8.6mil / Bottom Layer 0.035mm Outer layer thickness 1oz

## Design rules (mm)
template: JLCPCB Capability(Two Layers Board)
spacing copperThickness1oz (default): track to track 0.102, other pairs 0.152 to 0.3
spacing copperThickness2oz: track to track 0.203, other pairs 0.152 to 0.3
track width copperThickness1oz (default): min 0.127, default 0.254, max 2.54
track width copperThickness2oz: min 0.203, default 0.254, max 2.54
differential pair differentialPair (default): width min 0.127, default 0.254, max 2.54; gap min 0.152, default 0.152
via viaSize (default): diameter min 0.5, default 0.61, max 10; hole min 0.3, default 0.305, max 6.3

## Placement (name value [footprint] x y rotation side)
C1  100nF  [C0402]  35.69 88.41 270 top
C2  22pF  [C0402]  39.63 66.56 90 top
C3  22pF  [C0402]  37.97 66.56 90 top
C4  100nF  [C0402]  69.81 48.07 180 top
C5  100nF  [C0402]  31.12 78.88 90 top
C6  100nF  [C0402]  26.29 5.6 270 top
C7  100nF  [C0402]  50.93 76.98 270 top
C8  100nF  [C0402]  75.52 38.8 0 top
H3  DS1023-2*18SF11  [HDR-TH_36P-P2.54-V-F-R2-C18-S2.54-1]  31.37 26.18 90 top
H4  DS1023-2*16SF11  [HDR-TH_32P-P2.54-V-F-R2-C16-S2.54-1]  59.18 29.44 270 top
H5  DS1023-2*3SF11  [HDR-TH_6P-P2.54-V-F-R2-C3-S2.54]  57.91 6.58 180 top
LED  KT-0603R  [LED0603-RD]  94.44 46.8 0 top
PWR  KT-0603R  [LED0603-RD]  94.47 43.62 0 top
R1  10kΩ  [R1206]  37.34 63.52 180 top
R2  1kΩ  [R1206]  88.6 27.62 0 top
R3  1kΩ  [R1206]  88.6 30.8 0 top
R4  1kΩ  [R1206]  88.6 46.8 0 top
R5  1kΩ  [R1206]  88.6 43.62 0 top
R6  1kΩ  [R1206]  82.89 27.62 0 top
R7  1kΩ  [R1206]  82.92 30.82 0 top
RX  KT-0603R  [LED0603-RD]  94.44 27.62 0 top
SW1  TS-1088-AR02016  [SW-SMD_L3.9-W3.0-P4.45]  83.01 17.46 0 top
TX  KT-0603R  [LED0603-RD]  94.47 30.8 0 top
U1  ATMEGA2560-16AU  [TQFP-100_L14.0-W14.0-P0.50-LS16.0-BL]  41.15 77.61 270 top
U2  CH340G  [SOIC-16_L9.9-W3.9-P1.27-LS6.0-BL]  77.43 45.27 0 top
USB1  920-E52A2021S10100  [MICRO-USB-SMD_5P-P0.65-H-F_C10418]  93.43 38.16 90 top
X1  16MHz  [HC-49S_L11.4-W4.8]  40.39 57.17 180 top

## Footprints (pads in the part's own frame, mm; a bottom-side part is the same pattern mirrored in y, then rotated)
C0402
  rect 0.79x0.54 smd: 1(-0.545,0) 2(0.545,0)
HC-49S_L11.4-W4.8
  rect 5.5x1.3 smd: 1(-4.553,0) 2(4.553,0)
HDR-TH_6P-P2.54-V-F-R2-C3-S2.54
  rect 1.7x1.6 hole 1: 1(-2.54,-1.27)
  round 1.6 hole 1: 2(-2.54,1.27) 3(0,-1.27) 4(0,1.27) 5(2.54,-1.27) 6(2.54,1.27)
HDR-TH_32P-P2.54-V-F-R2-C16-S2.54-1
  rect 2x2 hole 1.2: 1(-19.05,-1.27)
  round 2 hole 1.2: 2(-19.05,1.27) 3(-16.51,-1.27) 4(-16.51,1.27) 5(-13.97,-1.27) 6(-13.97,1.27) 7(-11.43,-1.27) 8(-11.43,1.27) 9(-8.89,-1.27) 10(-8.89,1.27) 11(-6.35,-1.27) 12(-6.35,1.27) 13(-3.81,-1.27) 14(-3.81,1.27) 15(-1.27,-1.27) 16(-1.27,1.27) 17(1.27,-1.27) 18(1.27,1.27) 19(3.81,-1.27) 20(3.81,1.27) 21(6.35,-1.27) 22(6.35,1.27) 23(8.89,-1.27) 24(8.89,1.27) 25(11.43,-1.27) 26(11.43,1.27) 27(13.97,-1.27) 28(13.97,1.27) 29(16.51,-1.27) 30(16.51,1.27) 31(19.05,-1.27) 32(19.05,1.27)
HDR-TH_36P-P2.54-V-F-R2-C18-S2.54-1
  rect 1.7x1.7 hole 1.1: 1(-21.59,-1.27)
  round 1.7 hole 1.1: 2(-21.59,1.27) 3(-19.05,-1.27) 4(-19.05,1.27) 5(-16.51,-1.27) 6(-16.51,1.27) 7(-13.97,-1.27) 8(-13.97,1.27) 9(-11.43,-1.27) 10(-11.43,1.27) 11(-8.89,-1.27) 12(-8.89,1.27) 13(-6.35,-1.27) 14(-6.35,1.27) 15(-3.81,-1.27) 16(-3.81,1.27) 17(-1.27,-1.27) 18(-1.27,1.27) 19(1.27,-1.27) 20(1.27,1.27) 21(3.81,-1.27) 22(3.81,1.27) 23(6.35,-1.27) 24(6.35,1.27) 25(8.89,-1.27) 26(8.89,1.27) 27(11.43,-1.27) 28(11.43,1.27) 29(13.97,-1.27) 30(13.97,1.27) 31(16.51,-1.27) 32(16.51,1.27) 33(19.05,-1.27) 34(19.05,1.27) 35(21.59,-1.27) 36(21.59,1.27)
LED0603-RD
  rect 0.8x0.8 smd: 1(-0.799,0) 2(0.799,0)
MICRO-USB-SMD_5P-P0.65-H-F_C10418
  rect 0.4x1.25 smd: 1(-1.3,1.325) 2(-0.65,1.325) 3(0,1.325) 4(0.65,1.325) 5(1.3,1.325)
  round 1.2 hole 0.7: SH0(-2.425,1.325) SH3(2.425,1.325)
  oval 1.3x2.2 hole 0.7x1.5: SH1(-3.6,-1.325) SH2(3.6,-1.325)
R1206
  rect 1.208x1.701 smd: 1(-1.479,0) 2(1.479,0)
SOIC-16_L9.9-W3.9-P1.27-LS6.0-BL
  oval 0.602x1.971 smd: 1(-4.445,-2.736) 2(-3.175,-2.736) 3(-1.905,-2.736) 4(-0.635,-2.736) 5(0.635,-2.736) 6(1.905,-2.736) 7(3.175,-2.736) 8(4.445,-2.736) 9(4.445,2.736) 10(3.175,2.736) 11(1.905,2.736) 12(0.635,2.736) 13(-0.635,2.736) 14(-1.905,2.736) 15(-3.175,2.736) 16(-4.445,2.736)
SW-SMD_L3.9-W3.0-P4.45
  rect 1.23x1.36 smd: 1(-2.185,0) 2(2.185,0)
TQFP-100_L14.0-W14.0-P0.50-LS16.0-BL
  oval 0.28x1.6 smd: 1(-6,-7.7) 2(-5.5,-7.7) 3(-5,-7.7) 4(-4.5,-7.7) 5(-4,-7.7) 6(-3.5,-7.7) 7(-3,-7.7) 8(-2.5,-7.7) 9(-2,-7.7) 10(-1.5,-7.7) 11(-1,-7.7) 12(-0.5,-7.7) 13(0,-7.7) 14(0.5,-7.7) 15(1,-7.7) 16(1.5,-7.7) 17(2,-7.7) 18(2.5,-7.7) 19(3,-7.7) 20(3.5,-7.7) 21(4,-7.7) 22(4.5,-7.7) 23(5,-7.7) 24(5.5,-7.7) 25(6,-7.7) 51(6,7.7) 52(5.5,7.7) 53(5,7.7) 54(4.5,7.7) 55(4,7.7) 56(3.5,7.7) 57(3,7.7) 58(2.5,7.7) 59(2,7.7) 60(1.5,7.7) 61(1,7.7) 62(0.5,7.7) 63(0,7.7) 64(-0.5,7.7) 65(-1,7.7) 66(-1.5,7.7) 67(-2,7.7) 68(-2.5,7.7) 69(-3,7.7) 70(-3.5,7.7) 71(-4,7.7) 72(-4.5,7.7) 73(-5,7.7) 74(-5.5,7.7) 75(-6,7.7)
  oval 1.6x0.28 smd: 26(7.7,-6) 27(7.7,-5.5) 28(7.7,-5) 29(7.7,-4.5) 30(7.7,-4) 31(7.7,-3.5) 32(7.7,-3) 33(7.7,-2.5) 34(7.7,-2) 35(7.7,-1.5) 36(7.7,-1) 37(7.7,-0.5) 38(7.7,0) 39(7.7,0.5) 40(7.7,1) 41(7.7,1.5) 42(7.7,2) 43(7.7,2.5) 44(7.7,3) 45(7.7,3.5) 46(7.7,4) 47(7.7,4.5) 48(7.7,5) 49(7.7,5.5) 50(7.7,6) 76(-7.7,6) 77(-7.7,5.5) 78(-7.7,5) 79(-7.7,4.5) 80(-7.7,4) 81(-7.7,3.5) 82(-7.7,3) 83(-7.7,2.5) 84(-7.7,2) 85(-7.7,1.5) 86(-7.7,1) 87(-7.7,0.5) 88(-7.7,0) 89(-7.7,-0.5) 90(-7.7,-1) 91(-7.7,-1.5) 92(-7.7,-2) 93(-7.7,-2.5) 94(-7.7,-3) 95(-7.7,-3.5) 96(-7.7,-4) 97(-7.7,-4.5) 98(-7.7,-5) 99(-7.7,-5.5) 100(-7.7,-6)

## Nets
3V: C8.2 U2.4
GND: C1.2 C2.1 C3.1 C5.1 C6.1 C7.1 C8.1 H3.3 H3.4 R4.1 R5.1 SW1.1 U1.11 U1.32 U1.62 U1.81 U1.99 U2.1 USB1.5 USB1.SH0 USB1.SH1 USB1.SH2 USB1.SH3
VCC: C5.2 C6.2 C7.2 H3.1 H3.2 PWR.2 R1.1 RX.2 TX.2 U1.10 U1.31 U1.61 U1.80 U1.100 USB1.1
A0: H4.2 U1.97
A1: H4.1 U1.96
A2: H4.4 U1.95
A3: H4.3 U1.94
A4: H4.6 U1.93
A5: H4.5 U1.92
A6: H4.8 U1.91
A7: H4.7 U1.90
A8: H4.10 U1.89
A9: H4.9 U1.88
A10: H4.12 U1.87
A11: H4.11 U1.86
A12: H4.14 U1.85
A13: H4.13 U1.84
A14: H4.16 U1.83
A15: H4.15 U1.82
D2: H3.8 U1.6
D3: H3.7 U1.7
D4: H3.10 U1.1
D5: H3.9 U1.5
D6: H3.12 U1.15
D7: H3.11 U1.16
D8: H3.14 U1.17
D9: H3.13 U1.18
D10: H3.16 U1.23
D11: H3.15 U1.24
D12: H3.18 U1.25
D13: H3.17 LED.2 U1.26
D14: H3.20 U1.64
D15: H3.19 U1.63
D16: H3.22 U1.13
D17: H3.21 U1.12
D18: H3.24 U1.46
D19: H3.23 U1.45
D20: H3.26 U1.44
D21: H3.25 U1.43
D22: H3.28 U1.78
D23: H3.27 U1.77
D24: H3.30 U1.76
D25: H3.29 U1.75
D26: H3.32 U1.74
D27: H3.31 U1.73
D28: H3.34 U1.72
D29: H3.33 U1.71
D30: H3.36 U1.60
D31: H3.35 U1.59
D32: H4.18 U1.58
D33: H4.17 U1.57
D34: H4.20 U1.56
D35: H4.19 U1.55
D36: H4.22 U1.54
D37: H4.21 U1.53
D38: H4.24 U1.50
D39: H4.23 U1.70
D40: H4.26 U1.52
D41: H4.25 U1.51
D42: H4.28 U1.42
D43: H4.27 U1.41
D44: H4.30 U1.40
D45: H4.29 U1.39
D46: H4.32 U1.38
D47: H4.31 U1.37
D48: H5.2 U1.36
D49: H5.1 U1.35
D53: H5.5 U1.19
D+: U2.5 USB1.3
D-: U2.6 USB1.2
MISO: H5.4 U1.22
MOSI: H5.3 U1.21
RST: C4.2 R1.2 SW1.2 U1.30
RX: R7.1 U2.3
RX0: H3.6 R2.1 R6.2 U1.2
SCK: H5.6 U1.20
TX: R6.1 U2.2
TX0: H3.5 R3.1 R7.2 U1.3
$1N1069: C1.1 U1.98
$1N1420: C2.2 U1.34 X1.1
$1N1443: C3.2 U1.33 X1.2
$1N1959: C4.1 U2.13
$1N2135: R2.2 RX.1
$1N2257: R3.2 TX.1
$1N2730: LED.1 R4.2
$1N2846: PWR.1 R5.2

Pads without a net: U1 4 8 9 14 27 28 29 47 48 49 65 66 67 68 69 79; U2 7 8 9 10 11 12 14 15 16; USB1 4

## Via types
v1: diameter 0.61, hole 0.305, Top Layer to Bottom Layer, 112 vias

## Routing (per net, layer and track width the routed paths; a pad name or vN(x,y) marks a point on that pad's centre or on a via; arc(x,y) is an arc through that point)
3V: length 4.1
  Top Layer w0.254: C8.2 v1(76.07,39.81) ; v1(76.83,41.08) 76.83,42.5 U2.4
  Inner2 w0.254: v1(76.07,39.81) 76.07,40.32 v1(76.83,41.08)
GND: length 270.7
  Top Layer w0.252: C7.1 50.93,83.29 49.91,84.31 47.63,84.31 ; 47.63,84.31 47.63,86.85 44.58,89.9 35.43,89.9 34.93,89.39 34.93,88.63 C1.2 35.69,85.35 U1.99 35.65,80.05 34.21,78.61 U1.11 31.39,78.61 C5.1 ; 47.63,84.31 47.37,84.05 v1(45.85,84.05) 45.09,84.05 44.65,84.49 U1.81 ; U1.62 48.77,77.2 48.01,77.2 47.75,77.45 v1(47.24,77.45) 46.23,76.43 46.23,75.93 43.69,73.39 39.11,73.39 38.15,72.42 U1.32 ; v1(38.99,66.27) 38.23,66.27 C3.1
  Top Layer w0.254: USB1.SH2 93.58,40.59 92.1,40.59 ; 92.1,40.59 USB1.5 ; 92.1,40.59 90.16,40.59 87.12,43.62 ; C2.1 39.37,66.27 v1(38.99,66.27) ; v1(82.6,43.56) 87.05,43.56 87.12,43.62 ; 87.12,43.62 87.12,46.8 ; v1(74.98,39.49) C8.1 ; v1(85.66,26.94) 85.66,22.29 SW1.1 69.84,6.47 33.3,6.47 H3.3 H3.4 27.27,7.13 C6.1 ; C7.1 50.93,77.49 51.49,76.93 51.49,56.89 49.1,54.5 49.1,51.33 50.17,50.26 50.24,50.26 50.57,49.93 51.12,49.93 51.17,49.89 56.41,49.89 56.65,50.13 59.18,50.13 59.42,49.89 65.63,49.89 72.98,42.54 72.98,41.02 v1(73.49,40.51)
  Inner1 w0.252: v1(47.24,77.45) 46.23,76.43 46.23,75.42 39.88,69.07 39.62,69.07 38.99,68.44 v1(38.99,66.27)
  Inner2 w0.252: v1(47.24,77.45) 47.24,78.72 46.86,79.1 46.86,79.99 47.37,80.5 47.37,82.53 v1(45.85,84.05)
  Bottom Layer w0.254: 93.28,34.56 USB1.SH1 ; 93.28,34.56 v1(85.66,26.94) ; 93.28,34.56 USB1.SH0 90.41,35.74 v1(82.6,43.56) 81.58,43.56 78.43,40.41 75.64,40.41 74.98,39.75 v1(74.98,39.49) 74.76,39.49 73.74,40.51 v1(73.49,40.51)
VCC: length 230.9
  Top Layer w0.252: v1(40.31,65.2) 38.82,63.72 R1.1 ; 49,76.64 50.73,76.64 C7.2 ; 49,76.64 U1.61 ; 49,76.64 v1(47.73,76.64) ; v1(44.43,86.8) 45.15,86.08 U1.80 ; v1(38.02,73.84) 37,73.84 36.24,73.08 36.24,72.3 37.65,70.89 U1.31 ; U1.100 35.11,85.27 v1(34.67,85.27) 33.66,85.27 31.12,82.73 C5.2 31.43,79.11 U1.10
  Top Layer w0.254: 92.82,36.86 96.28,40.32 96.28,42.61 PWR.2 ; 92.82,36.86 93.33,36.35 93.33,32.73 TX.2 95.27,27.64 RX.2 88.41,20.79 88.41,18.99 85.93,16.5 84.12,16.5 71.86,4.24 54.93,4.24 54.57,4.59 32.64,4.59 ; 92.82,36.86 USB1.1 ; C6.2 26.51,4.84 v1(28.83,4.84) ; v1(38.06,59.71) 38.06,62.75 R1.1
  Inner2 w0.252: v1(47.73,76.64) 48.75,77.65 48.75,82.48 v1(44.43,86.8) 44.07,86.8 43.56,87.3 42.04,87.3 39.63,84.9 35.04,84.9 v1(34.67,85.27) ; v1(40.31,65.2) 41.32,66.22 41.32,69.02 40.81,69.52 40.56,69.52 38.02,72.06 v1(38.02,73.84)
  Bottom Layer w0.252: v1(47.73,76.64) 44.94,73.84 v1(38.02,73.84)
  Bottom Layer w0.254: v1(38.06,59.71) 38.82,58.94 38.82,10.77 32.64,4.59 H3.2 29.08,4.59 v1(28.83,4.84)
A0: length 86.4
  Top Layer w0.254: v1(49.74,47.43) 55.62,47.43 56.63,48.45 56.63,49.61 56.8,49.77 59.03,49.77 59.19,49.61 59.19,47.63 59.39,47.43 H4.2 ; v1(49.49,69.4) 49.56,69.4 49.74,69.22 49.74,58.66 47.97,56.89 47.97,56.4 47.81,56.24 47.31,56.24 v1(47.1,56.03) ; v1(36.66,86.93) 36.66,85.32 U1.97
  Inner1 w0.254: v1(49.74,47.43) 48.09,47.43 44.02,51.5 44.02,51.75 v1(44.28,52.01)
  Inner2 w0.254: v1(49.49,69.4) 53.93,73.85 53.93,88.84 53.75,89.02 47.02,89.02 46.06,89.98 37.17,89.98 36.91,89.72 36.91,87.18 v1(36.66,86.93)
  Bottom Layer w0.254: v1(44.28,52.01) 47.1,54.83 v1(47.1,56.03)
A1: length 64.4
  Top Layer w0.252: v1(40.91,89.12) 39.36,89.12 38.96,88.73 38.72,88.73 37.8,87.8 37.8,87.56 37.24,87.01 37.24,86.69 37.15,86.6 U1.96
  Bottom Layer w0.252: v1(40.91,89.12) 41.67,89.89 45.22,89.89 52.33,82.78 52.33,73.13 48.77,69.58 48.77,51.29 51.56,48.49 H4.1
A3: length 63
  Top Layer w0.252: U1.94 38.15,87.66 38.86,88.37 42.42,88.37 43.44,89.39 43.94,89.39 v1(44.2,89.13)
  Inner1 w0.252: H4.3 53.85,45.95 48.26,51.54 48.26,57.38 51.31,60.43 51.31,80.75 44.2,87.86 v1(44.2,89.13)
A5: length 51.9
  Top Layer w0.252: v1(39.15,77.16) U1.92
  Inner1 w0.252: H4.5 55.63,43.41 38.13,60.91 38.13,72.34 39.15,73.35 v1(39.15,77.16)
A7: length 54.2
  Top Layer w0.252: v1(40.64,83.29) 40.15,83.78 U1.90
  Inner1 w0.252: v1(45.72,82.02) 44.45,83.29 v1(40.64,83.29)
  Inner2 w0.252: H4.7 46.48,52.3 46.48,59.67 45.47,60.69 v1(45.47,76.18)
  Bottom Layer w0.252: v1(45.72,82.02) 45.47,81.77 v1(45.47,76.18)
A9: length 60
  Top Layer w0.252: U1.88 41.15,83.8 41.4,83.55 41.4,83.04 v1(40.89,82.53)
  Inner1 w0.252: H4.9 53.6,38.33 38.86,53.07 38.86,55.1 v1(38.1,55.86)
  Inner2 w0.252: v1(38.86,72.12) 38.86,75.93 40.89,77.96 v1(40.89,82.53)
  Bottom Layer w0.252: v1(38.86,72.12) 37.08,70.34 37.08,56.88 v1(38.1,55.86)
A11: length 58.6
  Top Layer w0.252: v1(42.17,86.57) 42.17,85.33 U1.86
  Inner2 w0.252: H4.11 42.93,50.78 42.93,85.81 v1(42.17,86.57)
A13: length 59
  Top Layer w0.252: v1(42.13,79.2) 43.15,80.21 U1.84
  Inner2 w0.252: v1(42.13,79.2) 42.39,78.94 42.39,48.78 H4.13
A15: length 60.9
  Top Layer w0.252: v1(44.4,79.02) 44.15,79.28 U1.82 ; v1(48.77,49) 48.77,39.86 H4.15
  Inner2 w0.252: v1(44.4,79.02) 43.67,78.28 43.67,54.11 v1(48.77,49)
D2: length 73.6
  Top Layer w0.252: v1(32.18,79.98) 32.18,80.61 32.69,81.11 U1.6
  Inner2 w0.252: H3.8 27.31,15 27.31,66.31 32.89,71.9 32.89,79.27 v1(32.18,79.98)
D3: length 74.5
  Top Layer w0.252: v1(34.59,80.61) U1.7
  Bottom Layer w0.252: H3.7 31.37,13.48 31.37,22.88 30.61,23.64 29.59,23.64 28.32,24.91 28.32,74.34 v1(34.59,80.61)
D4: length 73.1
  Top Layer w0.252: U1.1 33.4,83.66 v1(33.4,84.09)
  Inner1 w0.252: v1(33.4,84.09) 33.4,76.98 27.81,71.39 27.81,17.03 H3.10
D5: length 72.5
  Top Layer w0.252: v1(30.61,75.71) 27.81,72.92 27.81,22.88 29.59,21.1 30.61,21.1 31.37,20.34 31.37,16.02 H3.9 ; v1(32.13,81.55) 33.39,81.55 U1.5
  Inner2 w0.252: v1(32.13,81.55) 30.61,80.03 v1(30.61,75.71)
D6: length 64.7
  Top Layer w0.252: H3.12 27.31,20.08 27.31,73.27 30.66,76.61 U1.15
D7: length 64.8
  Top Layer w0.252: v1(34.67,75.4) 34.67,75.65 34.21,76.11 U1.16
  Inner2 w0.252: v1(34.67,75.4) 33.4,74.13 33.4,53.61 28.32,48.53 28.32,32.53 29.59,31.26 30.61,31.26 31.37,30.5 31.37,18.56 H3.11
D8: length 59.8
  Top Layer w0.252: U1.17 32.18,75.61 30.61,74.04 v1(30.61,68.6)
  Inner2 w0.252: H3.14 27.81,22.12 27.81,65.8 v1(30.61,68.6)
D9: length 60.3
  Top Layer w0.252: v1(32.13,74.69) 32.55,75.11 U1.18
  Inner1 w0.252: v1(32.13,74.69) 28.32,70.88 28.32,32.53 29.59,31.26 30.61,31.26 31.37,30.5 31.37,21.1 H3.13
D10: length 53.1
  Top Layer w0.252: U1.23 34.21,72.61 34.67,72.15 34.67,70.12 31.37,66.82 31.37,23.64 H3.16
D11: length 52.7
  Top Layer w0.252: v1(32.64,70.8) 32.13,71.31 32.13,71.56 32.69,72.11 U1.24
  Inner1 w0.252: H3.15 33.91,23.64 33.91,50.06 31.78,52.19 31.78,69.93 v1(32.64,70.8)
D12: length 49.8
  Top Layer w0.252: U1.25 33.45,69.66 28.83,65.04 28.83,34.56 v1(29.59,33.8)
  Bottom Layer w0.252: v1(29.59,33.8) 28.83,33.04 28.83,26.18 H3.18
D13: length 134.7
  Top Layer w0.252: H3.17 34.93,27.19 34.93,54.12 32.64,56.41 32.64,67.41 U1.26
  Inner2 w0.254: H3.17 41.59,24.91 57.38,9.12 60.98,9.12 61.73,9.86 61.73,13.32 95.21,46.8
D14: length 63.9
  Top Layer w0.252: U1.64 46.56,78.11 46.36,77.91 41.78,77.91 v1(41.02,77.14)
  Bottom Layer w0.252: H3.20 31.37,28.72 33.15,28.72 36.2,31.77 36.2,73.08 38.99,75.88 39.75,75.88 v1(41.02,77.14)
D15: length 61.6
  Top Layer w0.252: v1(44.32,72.33) 43.9,71.9 v1(41.78,71.9) ; v1(50.07,77.41) 49.86,77.61 U1.63
  Inner1 w0.252: v1(44.32,72.33) 44.99,72.33 v1(50.07,77.41)
  Inner2 w0.252: H3.19 43.56,38.37 v1(43.56,39.89)
  Bottom Layer w0.252: v1(43.56,39.89) 42.29,41.17 42.29,71.39 v1(41.78,71.9)
D16: length 51
  Top Layer w0.252: U1.13 32.51,77.61 v1(32.13,77.23) ; H3.22 28.32,31.77 28.32,72.41 31.37,75.45 v1(31.37,75.96)
  Bottom Layer w0.252: v1(31.37,75.96) 31.37,76.47 v1(32.13,77.23)
D17: length 50.1
  Top Layer w0.252: U1.12 34.21,78.11 34.93,77.4 v1(34.93,76.72)
  Bottom Layer w0.252: H3.21 33.91,31.26 33.91,75.71 v1(34.93,76.72)
D18: length 58.1
  Top Layer w0.252: v1(39.5,72.66) 39.75,72.92 44.58,72.92 45.15,72.34 U1.46
  Inner1 w0.252: H3.24 31.37,33.8 31.37,72.66 32.41,73.7 36.68,73.7 v1(37.21,73.17)
  Bottom Layer w0.252: v1(39.5,72.66) 38.99,73.17 v1(37.21,73.17)
D19: length 43.5
  Top Layer w0.252: U1.45 44.65,68.78 v1(44.83,68.6)
  Inner1 w0.252: v1(44.83,68.6) 44.83,66.31 v1(39.75,61.23)
  Inner2 w0.252: H3.23 40.89,40.78 40.89,60.1 v1(39.75,61.23)
D20: length 47.7
  Top Layer w0.252: U1.44 44.15,61.15 v1(44.83,60.47)
  Inner1 w0.252: v1(44.83,60.47) 45.59,59.71 45.59,59.2 45.09,58.69 41.28,58.69 v1(39.75,60.22)
  Inner2 w0.252: H3.26 31.37,36.34 31.37,45.74 32.13,46.5 33.15,46.5 37.21,50.56 37.21,51.58 39.75,54.12 v1(39.75,60.22)
D21: length 50.1
  Top Layer w0.252: v1(43.56,43.96) 41.87,45.65 41.87,58.02 43.65,59.79 U1.43
  Inner2 w0.252: H3.25 31.37,33.8 31.37,32.02 32.13,31.26 33.15,31.26 43.56,41.67 v1(43.56,43.96)
D22: length 61.3
  Top Layer w0.252: v1(39.59,86.89) 40.1,87.39 44.83,87.39 46.15,86.08 U1.78
  Bottom Layer w0.252: H3.28 31.37,38.88 31.37,70.38 32.99,71.99 32.99,76.47 39.59,83.08 v1(39.59,86.89)
D23: length 68.7
  Top Layer w0.252: v1(38.74,87.31) 39.24,87.81 45.09,87.81 46.65,86.25 U1.77
  Bottom Layer w0.252: v1(38.74,87.31) 38.74,82.99 32.39,76.64 32.39,75.88 28.83,72.32 28.83,37.1 29.59,36.34 31.37,36.34 H3.27
D24: length 63.5
  Top Layer w0.252: v1(43.56,88.59) 43.82,88.33 45.34,88.33 47.15,86.52 U1.76
  Inner1 w0.252: v1(43.56,88.59) 42.95,87.98 38.38,87.98 38.13,87.72 38.13,80.86 34.16,76.9 34.16,75.89 32.39,74.11 32.13,74.11 28.83,70.81 28.83,41.42 H3.30
D25: length 57.2
  Top Layer w0.252: v1(36.96,72.41) 37.47,72.41 42.29,77.23 v1(44.83,77.23) ; v1(45.85,83.08) 46.39,83.61 U1.75
  Inner1 w0.252: v1(39.75,53.1) 39.75,57.17 36.2,60.72 36.2,71.64 v1(36.96,72.41)
  Inner2 w0.252: v1(39.75,53.1) 39.75,47.26 H3.29
  Bottom Layer w0.252: v1(44.83,77.23) 43.82,78.25 43.82,81.04 v1(45.85,83.08)
D26: length 64.6
  Top Layer w0.252: U1.74 48.89,83.08 v1(50.08,83.08)
  Inner2 w0.252: H3.32 28.83,43.96 28.83,48.28 34.42,53.86 34.42,71.14 35.69,72.41 35.69,80.79 v1(36.96,82.06)
  Bottom Layer w0.252: v1(50.08,83.08) 45.25,87.9 38.48,87.9 36.96,86.38 v1(36.96,82.06)
D27: length 52.1
  Top Layer w0.252: U1.73 47.17,82.61 v1(46.61,82.06)
  Inner1 w0.252: v1(42.29,80.28) 44.83,80.28 v1(46.61,82.06) ; v1(37.97,51.33) 36.31,52.98 36.31,57.3 v1(35.18,58.44)
  Inner2 w0.252: H3.31 37.97,48.02 v1(37.97,51.33)
  Bottom Layer w0.252: v1(42.29,80.28) 41.53,79.52 41.53,78.5 39.5,76.47 38.99,76.47 34.67,72.15 34.67,58.94 v1(35.18,58.44)
D28: length 52.1
  Top Layer w0.252: U1.72 48.09,82.11 47.63,81.65 47.63,81.4 44.58,78.35 42.04,78.35 v1(40.01,80.38)
  Inner2 w0.252: H3.34 31.37,46.5 31.37,48.28 32.89,49.8 v1(33.15,49.8)
  Bottom Layer w0.252: v1(40.01,80.38) 37.72,80.38 33.4,76.06 33.4,50.06 v1(33.15,49.8)
D29: length 66.7
  Top Layer w0.252: v1(50.12,80.34) 50.12,81.11 49.61,81.61 U1.71 ; v1(37.47,45.99) 36.2,47.26 36.2,55.14 v1(35.43,55.9) ; v1(32.13,41.42) 33.15,41.42 33.91,42.18 33.91,43.96 H3.33
  Inner1 w0.252: v1(50.12,80.34) 49.1,80.34 46.75,78 41.78,78 40.77,79.01 40.77,80.53 v1(40.01,81.3)
  Inner2 w0.252: v1(35.43,55.9) 36.2,56.66 36.2,77.49 v1(40.01,81.3) ; v1(32.13,41.42) 33.15,41.42 37.47,45.74 v1(37.47,45.99)
D30: length 37.3
  Top Layer w0.252: v1(46.61,72.61) 46.61,74.64 48.13,76.16 48.8,76.16 U1.60
  Inner1 w0.252: v1(40.51,67.78) 41.78,67.78 v1(46.61,72.61)
  Inner2 w0.252: v1(40.51,67.78) 40.51,66.31 37.21,63.01 37.21,54.88 H3.36
D31: length 36.1
  Top Layer w0.252: v1(50.12,75.15) 49.66,75.61 U1.59
  Inner1 w0.252: v1(40.26,64.28) 41.02,65.04 41.02,66.06 v1(50.12,75.15)
  Inner2 w0.252: v1(40.26,64.28) 38.74,62.75 38.74,53.86 H3.35
D33: length 53.3
  Top Layer w0.252: U1.57 49.83,74.61 51.14,73.31 51.14,58.07 48.09,55.02 48.09,38 H4.17
D35: length 54.9
  Top Layer w0.252: H4.19 47.58,35.97 47.58,55.18 47.93,55.53 48.1,55.53 48.68,56.11 48.68,56.28 50.63,58.23 50.63,72.7 49.72,73.61 U1.55
D37: length 56.5
  Top Layer w0.252: H4.21 47.07,33.94 47.07,55.27 47.16,55.36 47.26,55.36 47.78,55.88 47.95,55.88 48.32,56.25 48.32,56.53 50.12,58.32 50.12,72.29 49.8,72.61 U1.53
D39: length 66.6
  Top Layer w0.252: v1(47.58,79.82) 47.58,80.61 48.06,81.09 48.82,81.09 U1.70
  Bottom Layer w0.252: v1(47.58,79.82) 48.77,78.63 48.77,76.69 47.77,75.69 47.77,30.7 H4.23
D41: length 60.3
  Top Layer w0.252: H4.25 45.29,30.63 v1(45.29,56.03) ; v1(48.85,70.51) U1.51
  Inner1 w0.252: v1(45.29,56.03) 48.85,59.59 v1(48.85,70.51)
D43: length 62.2
  Top Layer w0.252: H4.27 40.87,32.52 40.87,59.9 42.65,61.68 U1.41
D45: length 65
  Top Layer w0.252: H4.29 40.39,30.46 40.39,62.46 v1(40.13,62.72) ; U1.39 41.66,69.91 v1(41.66,65)
  Inner2 w0.252: v1(41.66,65) 41.66,64.24 v1(40.13,62.72)
D46: length 78.5
  Top Layer w0.252: v1(40.98,71.1) 41.15,70.93 U1.38
  Bottom Layer w0.252: v1(40.98,71.1) 41.15,70.93 41.15,65.51 40.89,65.26 40.89,60.69 41.15,60.43 41.15,23.86 56.64,8.36 56.64,7.35 57.41,6.58 58.42,6.58 59.18,7.35 59.18,9.12 H4.32
D47: length 69.3
  Top Layer w0.252: v1(40.56,68.81) 40.65,68.9 U1.37 ; v1(39.37,61.96) 39.12,61.7 39.12,29.19 H4.31
  Inner2 w0.252: v1(39.37,61.96) v1(39.38,61.95)
  Bottom Layer w0.252: v1(40.56,68.81) 40.3,69.06 39.63,69.06 39.13,68.55 39.13,68.3 39.63,67.79 39.63,65.76 39.38,65.5 v1(39.38,61.95)
D48: length 80.9
  Top Layer w0.252: U1.36 v1(40.15,71.18)
  Bottom Layer w0.252: v1(40.15,71.18) 38.37,69.41 38.37,60.77 40.66,58.48 40.66,20.89 55.14,6.41 55.9,6.41 56.66,5.65 56.66,4.89 57.42,4.13 59.27,4.13 H5.2
D49: length 75.4
  Top Layer w0.252: U1.35 39.65,68.64 v1(39.9,68.39)
  Inner1 w0.252: v1(35.58,54.17) 35.58,52.13 42.95,44.77 42.95,23.43 57.43,8.95 59.35,8.95 H5.1
  Inner2 w0.252: v1(39.9,68.39) 36.6,65.09 36.6,55.18 v1(35.58,54.17)
D53: length 77.1
  Top Layer w0.252: U1.19 34.21,74.61 35.48,73.34 v1(35.48,71.31)
  Inner1 w0.252: H5.5 42.34,20.89 42.34,44.64 34.47,52.52 34.47,70.3 v1(35.48,71.31)
D+: length 16
  Top Layer w0.254: U2.5 78.06,42.28 82.18,38.16 USB1.3
D-: length 15.4
  Top Layer w0.254: v1(90.96,37.51) USB1.2 ; U2.6 79.33,42.28 82.89,38.73 89.49,38.73 v1(89.74,38.98)
  Inner1 w0.254: v1(90.96,37.51) 89.74,38.73 v1(89.74,38.98)
MISO: length 80.3
  Top Layer w0.252: U1.22 v1(34.72,73.11)
  Inner1 w0.252: v1(34.72,73.11) 33.96,72.35 33.96,52.29 41.83,44.41 41.83,19.77 55.04,6.57 56.66,6.57 H5.4
MOSI: length 87.9
  Top Layer w0.252: v1(32.18,72.6) 32.18,73.11 32.69,73.61 U1.21
  Inner1 w0.252: v1(32.18,72.6) 33.45,71.33 33.45,52.02 41.32,44.15 41.32,17.84 54.53,4.63 54.53,4.38 54.79,4.12 58.34,4.12 59.1,4.89 59.1,6.66 H5.3
RST: length 83.8
  Top Layer w0.252: U1.30 37.13,69.9 37.13,68.6 35.86,67.33 R1.2
  Top Layer w0.254: SW1.2 88.06,20.32 88.06,31.81 87.8,32.07 86.79,32.07 77.39,41.46 77.39,43.5 76.88,44 73.32,44 69.26,48.07 69.26,48.99 v1(68.79,49.47)
  Inner2 w0.254: v1(46.06,62.04) 49.1,59 49.1,51.33 51.02,49.41 51.83,49.41 v1(52.15,49.08)
  Bottom Layer w0.254: v1(52.15,49.08) 52.53,49.47 56.49,49.47 56.8,49.77 60.98,49.77 61.29,49.47 v1(68.79,49.47)
RX: length 14.2
  Top Layer w0.254: R7.1 81.44,35.39 75.52,41.31 U2.3
RX0: length 145.6
  Top Layer w0.252: v1(31.88,82.31) 32.68,83.11 U1.2
  Top Layer w0.254: v1(61.85,7.13) 63.87,7.13 R6.2 87.12,27.62
  Inner1 w0.252: v1(31.88,82.31) 27.31,77.74 27.31,12.46 H3.6
  Inner2 w0.254: v1(61.85,7.13) 61.34,6.62 54.99,6.62 50.67,10.94 31.37,10.94 H3.6
SCK: length 81.5
  Top Layer w0.252: v1(32.43,69.54) 31.42,70.56 31.42,73.1 32.43,74.11 U1.20
  Inner1 w0.252: v1(32.43,69.54) 32.43,52.27 40.82,43.89 40.82,17.51 v1(53.01,5.31)
  Bottom Layer w0.252: v1(53.01,5.31) H5.6
TX: length 18.1
  Top Layer w0.254: v1(80.14,30.42) 74.25,36.3 U2.2 ; v1(81.66,28.89) 81.41,28.64 R6.1
  Bottom Layer w0.254: v1(81.66,28.89) v1(80.14,30.42)
TX0: length 143.3
  Top Layer w0.252: v1(34.67,81.39) 34.67,82.15 34.21,82.61 U1.3
  Top Layer w0.254: H3.5 33.33,8.97 60.87,8.97 81.45,29.55 83.13,29.55 R7.2 87.1,30.82 87.12,30.8
  Bottom Layer w0.252: H3.5 31.37,10.94 31.37,12.72 30.61,13.48 29.59,13.48 27.81,15.26 27.81,74.69 34.51,81.39 v1(34.67,81.39)
$1N1069: length 4.1
  Top Layer w0.252: U1.98 36.15,86.62 36.08,86.69 36.08,87.17 36.4,87.5 36.4,88.24 C1.1
$1N1420: length 15.8
  Top Layer w0.252: C2.2 39.15,67.59 U1.34
  Top Layer w0.254: X1.1 44.96,57.19 v1(44.96,59.49) ; C2.2 40.89,65.84 40.89,62.54 v1(41.66,61.78)
  Inner1 w0.254: v1(41.66,61.78) 42.67,61.78 v1(44.96,59.49)
$1N1443: length 15.8
  Top Layer w0.252: U1.33 38.65,68.63 38.48,68.63 37.97,68.13 C3.2
  Top Layer w0.254: 38.65,68.63 37.97,67.96 36.87,66.86 36.87,58.2 X1.2
$1N1959: length 7.8
  Top Layer w0.254: U2.13 76.79,48.49 75.94,49.34 71.62,49.34 C4.1
$1N2135: length 3.6
  Top Layer w0.254: RX.1 R2.2
$1N2257: length 3.6
  Top Layer w0.254: TX.1 R3.2
$1N2730: length 3.6
  Top Layer w0.254: LED.1 R4.2
$1N2846: length 3.6
  Top Layer w0.254: PWR.1 R5.2
